# EAGLE design Klon_SiriusK (EAGLE 6.4)
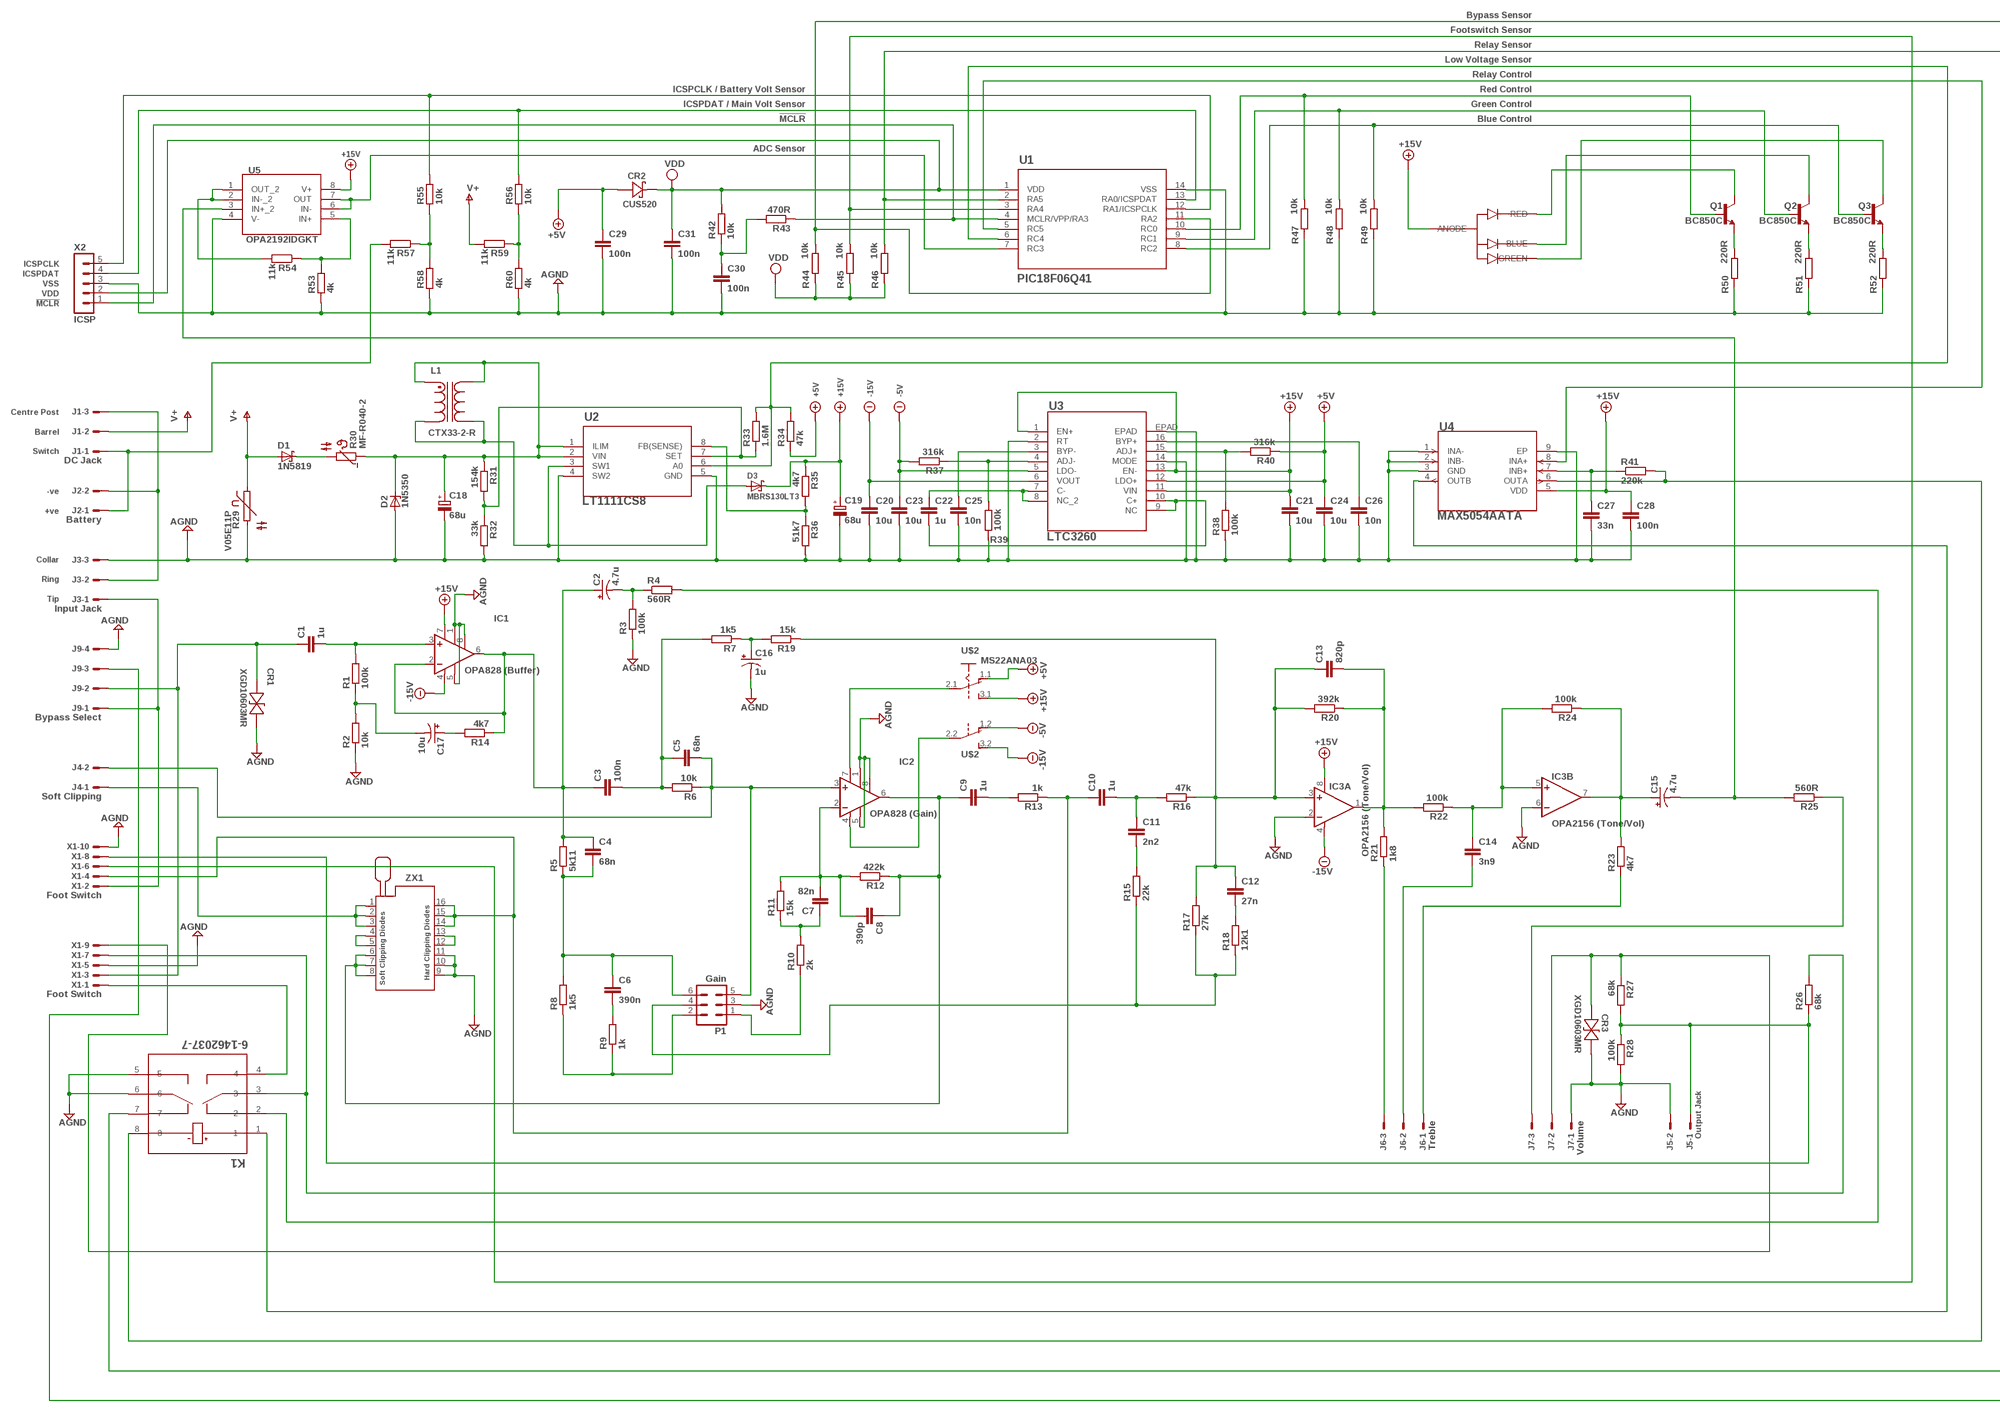
[diagram p0: schematic, sheet 1]

## Parts
C1  1u  C-EU225-108X268  [C225-108X268]
C2  4.7u  CPOL-USE15-5AXIAL  [E15-5]
C3  100n  C-EU102-064X133  [C102-064X133]
C4  68n  C-EU102-054X133  [C102-054X133]
C5  68n  C-EU102-054X133  [C102-054X133]
C6  390n  C-EU102-064X133  [C102-064X133]
C7  82n  C-EU102-064X133  [C102-064X133]
C8  390p  C-EU050-045X075  [C050-045X075]
C9  1u  C-EU225-108X268  [C225-108X268]
C10  1u  C-EU225-108X268  [C225-108X268]
C11  2n2  C-EU075-042X103  [C075-042X103]
C12  27n  C-EU102-064X133  [C102-064X133]
C13  820p  C-EU050-050X075  [C050-050X075]
C14  3n9  C-EU102-064X133  [C102-064X133]
C15  4.7u  CPOL-USE15-5AXIAL  [E15-5]
C16  1u  CPOL-USE2.5-4V  [E2,5RE]
C17  10u  CPOL-USE5-9VAXIAL  [E5R]
C18  68u  CPOL-EUSANYO_SMD_F12  [SANYO-OSCON_SMD_F12]
C19  68u  CPOL-EUSANYO_SMD_F12  [SANYO-OSCON_SMD_F12]
C20  10u  C-EUC1206K  [C1206K]
C21  10u  C-EUC1206K  [C1206K]
C22  1u  C-EUC0805K  [C0805K]
C23  10u  C-EUC1206K  [C1206K]
C24  10u  C-EUC1206K  [C1206K]
C25  10n  C-EUC0603K  [C0603K]
C26  10n  C-EUC0603K  [C0603K]
C27  33n  C-EUC0603K  [C0603K]
C28  100n  C-EUC0603K  [C0603K]
C29  100n  C-EUC0603K  [C0603K]
C30  100n  C-EUC0603K  [C0603K]
C31  100n  C-EUC0603K  [C0603K]
CR1  XGD10603MR  XGD10603NRZDO_XGD10603NR_LTF-M  [ZDO_XGD10603NR_LTF-M]
CR2  CUS520  CUS520USC_TOS-M  [USC_TOS-M]
CR3  XGD10603MR  XGD10603NRZDO_XGD10603NR_LTF-M  [ZDO_XGD10603NR_LTF-M]
D1  1N5819  1N5819-T  [DO41-7.6]
D2  1N5350  1N5333  [C1702-15]
D3  MBRS130LT3  [SMB]
IC1  OPA828 (Buffer)  OPA627P  [DIL08]
IC2  OPA828 (Gain)  OPA627P  [DIL08]
IC3  OPA2156 (Tone/Vol)  OPA2134P  [DIL08]
J1  DC Jack  22-27-2031-03  [6410-03]
J2  Battery  22-27-2021-02  [6410-02]
J3  Input Jack  22-27-2031-03  [6410-03]
J4  Soft Clipping  22-27-2021-02  [6410-02]
J5  Output Jack  22-27-2021-02  [6410-02]
J6  Treble  22-27-2031-03  [6410-03]
J7  Volume  22-27-2031-03  [6410-03]
J9  Bypass Select  22-27-2041-04  [6410-04]
K1  6-1462037-7  [RELAY8_SMTGUL_TEC]
L1  CTX33-2-R  [INDM889889X597N]
LED  WP154A4SEJ3VBDZGW/CA  5MMRGBLED  [LED5MMRGB]
P1  Gain  87831-06  [87831-06]
Q1  BC850C  BC850SMD  [SOT23-BEC]
Q2  BC850C  BC850SMD  [SOT23-BEC]
Q3  BC850C  BC850SMD  [SOT23-BEC]
R1  100k  R-EU_0309/12  [0309/12]
R2  10k  R-EU_0309/12  [0309/12]
R3  100k  R-EU_0309/12  [0309/12]
R4  560R  R-EU_0309/12  [0309/12]
R5  5k11  R-EU_0309/12  [0309/12]
R6  10k  R-EU_0309/12  [0309/12]
R7  1k5  R-EU_0309/12  [0309/12]
R8  1k5  R-EU_0309/12  [0309/12]
R9  1k  R-EU_0309/12  [0309/12]
R10  2k  R-EU_0309/12  [0309/12]
R11  15k  R-EU_0309/12  [0309/12]
R12  422k  R-EU_0309/12  [0309/12]
R13  1k  R-EU_0309/12  [0309/12]
R14  4k7  R-EU_0309/12  [0309/12]
R15  22k  R-EU_0309/12  [0309/12]
R16  47k  R-EU_0309/12  [0309/12]
R17  27k  R-EU_0309/12  [0309/12]
R18  12k1  R-EU_0309/12  [0309/12]
R19  15k  R-EU_0309/12  [0309/12]
R20  392k  R-EU_0309/12  [0309/12]
R21  1k8  R-EU_0309/12  [0309/12]
R22  100k  R-EU_0309/12  [0309/12]
R23  4k7  R-EU_0309/12  [0309/12]
R24  100k  R-EU_0309/12  [0309/12]
R25  560R  R-EU_0309/12  [0309/12]
R26  68k  R-EU_0309/12  [0309/12]
R27  68k  R-EU_0309/12  [0309/12]
R28  100k  R-EU_0309/12  [0309/12]
R29  V05E11P  S05K11  [S05K11]
R30  MF-R040-2  B57164  [B57164]
R31  154k  R-EU_R0603  [R0603]
R32  33k  R-EU_R0603  [R0603]
R33  1.6M  R-EU_R0603  [R0603]
R34  47k  R-EU_R0603  [R0603]
R35  4k7  R-EU_R0603  [R0603]
R36  51k7  R-EU_R0603  [R0603]
R37  316k  R-EU_R0603  [R0603]
R38  100k  R-EU_R0603  [R0603]
R39  100k  R-EU_R0603  [R0603]
R40  316k  R-EU_R0603  [R0603]
R41  220k  R-EU_R0603  [R0603]
R42  10k  R-EU_R0603  [R0603]
R43  470R  R-EU_R0603  [R0603]
R44  10k  R-EU_R0603  [R0603]
R45  10k  R-EU_R0603  [R0603]
R46  10k  R-EU_R0603  [R0603]
R47  10k  R-EU_R0603  [R0603]
R48  10k  R-EU_R0603  [R0603]
R49  10k  R-EU_R0603  [R0603]
R50  220R  R-EU_R0603  [R0603]
R51  220R  R-EU_R0603  [R0603]
R52  220R  R-EU_R0603  [R0603]
R53  4k  R-EU_R0603  [R0603]
R54  11k  R-EU_R0603  [R0603]
R55  10k  R-EU_R0603  [R0603]
R56  10k  R-EU_R0603  [R0603]
R57  11k  R-EU_R0603  [R0603]
R58  4k  R-EU_R0603  [R0603]
R59  11k  R-EU_R0603  [R0603]
R60  4k  R-EU_R0603  [R0603]
U1  PIC18F06Q41  PIC16F18426-I/STTSSOP14_ST_MCH-M  [TSSOP14_ST_MCH-M]
U2  LT1111CS8  LT1111CS8-5PBFSO-8_S_LIT-M  [SO-8_S_LIT-M]
U3  LTC3260  LTC3260IMSEPBFMSOP-16_MSE_LIT-M  [MSOP-16_MSE_LIT-M]
U4  MAX5054AATA  MAX5054AATA+T21-0137_T833+2_MXM-M  [21-0137_T833+2_MXM-M]
U5  OPA2192IDGKT  [DGK0008A_N_TEX]
U$2  MS22ANA03  [MS22ANA03]
X1  Foot Switch  87758-1016  [87758-1016]
X2  ICSP  MA05-1  [MA05-1]
ZX1  216-3340-00-0602J  [216-3340-00-0602J]

## Nets
+5V: C24.1 C29.1 CR2.2(ANODE) R34.1 R40.1 U3.12(LDO+) U$2.1.1(A:O)
+15V: C19.+ C21.1 C28.1 D3.C IC1.7(V+) IC3.8(A:V+) LED.P2(ANODE) R35.1 U3.1(EN+) U3.11(VIN) U3.13(EN-) U4.5(VDD) U5.8(V+) U$2.3.1(A:S)
-5V: C23.1 R37.2 U3.5(LDO-) U$2.1.2(B:O)
-15V: C20.1 IC1.4(V-) IC3.4(A:V-) U3.6(VOUT) U$2.3.2(B:S)
AGND: C16.- C18.- C19.- C20.2 C21.2 C23.2 C24.2 C25.2 C26.2 C27.2 C28.2 C29.2 C30.2 C31.2 CR1.1 CR3.1 D2.A IC1.1(TRIM1) IC1.5(TRIM2) IC1.8(NC) IC2.1(TRIM1) IC2.5(TRIM2) IC2.8(NC) IC3.2(A:-IN) IC3.6(B:-IN) J3.3 J5.2 J7.1 J9.4 K1.5 K1.6 P1.3 R2.1 R3.1 R28.2 R29.2 R32.2 R36.2 R38.1 R39.1 R47.1 R48.1 R49.1 R50.1 R51.1 R52.1 R53.1 R58.1 R60.1 U1.14(VSS) U2.4(SW2) U2.5(GND) U3.2(RT) U3.14(MODE) U3.EPAD U4.1(INA-) U4.2(INB-) U4.3(GND) U4.9(EP) U5.4(V-) X1.5 X1.10 X2.3 ZX1.9 ZX1.10 ZX1.11
N$1: J1.1 J2.1 R57.2
N$2: J1.3 J2.2 J3.2
N$3: C1.1 CR1.2 J9.2 X1.3
N$4: C1.2 IC1.3(+IN) R1.2
N$5: C17.- R1.1 R2.2
N$6: C2.+ C3.1 C4.1 IC1.2(-IN) IC1.6(OUT) R5.2 R14.1
N$7: D1.C R30.2
N$8: C17.+ R14.2
N$9: R37.1 R39.2 U3.4(ADJ-)
N$10: C13.2 IC3.1(A:OUT) R20.1 R21.2 R22.2
N$11: C4.2 C6.1 P1.6 R5.1 R8.2
N$12: C2.- R3.2 R4.1
N$13: C3.2 C5.1 R6.2 R7.2
N$14: C5.2 IC2.3(+IN) J4.2 P1.5 R6.1
N$15: C16.+ R7.1 R19.2
N$16: C6.2 R9.2
N$17: P1.2 R8.1 R9.1
N$18: C14.1 IC3.5(B:+IN) R22.1 R24.2
N$19: IC2.7(V+) U$2.2.1(A:P)
N$20: IC2.4(V-) U$2.2.2(B:P)
N$21: P1.4 R15.1 R17.1 R18.1
N$22: ZX1.4 ZX1.5
N$23: ZX1.12 ZX1.13
N$24: C10.1 R13.1 X1.4 ZX1.14 ZX1.15 ZX1.16
N$25: J6.3 R21.1
N$26: C14.2 J6.2
N$27: J4.1 ZX1.1 ZX1.2 ZX1.3
N$28: C15.+ IC3.7(B:OUT) R23.2 R24.1
N$29: P1.1 R10.1
N$30: C7.1 R10.2 R11.1
N$31: C7.2 C8.2 IC2.2(-IN) R11.2 R12.2
N$32: J6.1 R23.1
N$33: C8.1 C9.1 IC2.6(OUT) R12.1 ZX1.6 ZX1.7 ZX1.8
N$34: C15.- R25.2 U5.3(IN+_2)
N$35: J7.3 R25.1
N$36: J3.1 J9.1 X1.2
N$37: C9.2 R13.2
N$38: J5.1 R26.1 R27.2 R28.1 X1.8
N$39: C10.2 C11.1 R16.2
N$40: C11.2 R15.2
N$41: C12.1 C13.1 IC3.3(A:+IN) R16.1 R17.2 R19.1 R20.2
N$42: C12.2 R18.2
N$43: CR3.2 J7.2 R27.1 X1.9
N$44: K1.4 X1.1
N$45: K1.2 R4.2
N$46: K1.3 R26.2 X1.7
N$47: K1.1 U4.4(OUTB)
N$48: K1.8 R41.2 U4.6(OUTA)
N$49: Q3.E R52.2
N$50: Q2.E R51.2
N$51: J9.3 R44.2 U1.11(RA2)
N$52: R31.2 R32.1 R33.1 U2.7(SET)
N$53: Q1.E R50.2
N$54: C18.+ D2.C L1.1 L1.4 R30.1 R31.1 U2.1(ILIM) U2.2(VIN)
N$55: C22.1 U3.7(C-) U3.8(NC_2)
N$56: D3.A L1.2 L1.3 U2.3(SW1)
N$57: R35.2 R36.1 U2.8(FB(SENSE))
N$59: R38.2 R40.2 U3.15(ADJ+)
N$60: C27.1 R41.1 U4.7(INB+)
N$61: R54.2 U5.1(OUT_2) U5.2(IN-_2)
N$62: R56.2 U1.13(RA0/ICSPDAT) X2.4
N$63: C26.1 U3.16(BYP+)
N$64: R55.2 U1.12(RA1/ICSPCLK) X2.5
N$65: C25.1 U3.3(BYP-)
N$66: R43.1 U1.4(MCLR/VPP/RA3) X2.1
N$67: K1.7 R46.2 U1.2(RA5)
N$69: R45.2 U1.3(RA4) X1.6
N$70: C30.1 R42.1 R43.2
N$71: LED.P1(RED) Q1.C
N$72: U1.5(RC5) U4.8(INA+)
N$73: Q1.B R47.2 U1.10(RC0)
N$74: Q2.B R48.2 U1.9(RC1)
N$75: Q3.B R49.2 U1.8(RC2)
N$76: R33.2 R34.2 U1.6(RC4) U2.6(A0)
N$77: LED.P3(BLUE) Q2.C
N$78: LED.P4(GREEN) Q3.C
N$79: U1.7(RC3) U5.6(IN-) U5.7(OUT)
N$80: R56.1 R59.1 R60.2
N$81: R53.2 R54.1 U5.5(IN+)
N$82: R55.1 R57.1 R58.2
N$83: C22.2 U3.9(NC) U3.10(C+)
V+: D1.A J1.2 R29.1 R59.2
VDD: C31.1 CR2.1(CATHODE) R42.2 R44.1 R45.1 R46.1 U1.1(VDD) X2.2

## Notes on the sheet
- Bypass Sensor
- Footswitch Sensor
- Relay Sensor
- Low Voltage Sensor
- Relay Control
- ICSPCLK / Battery Volt Sensor | Red Control
- ICSPDAT / Main Volt Sensor | Green Control
- !MCLR! | Blue Control
- ADC Sensor
- ICSPCLK
- ICSPDAT
- VSS
- VDD
- !MCLR!
- Centre Post
- Barrel
- Switch
- -ve
- +ve
- Collar
- Ring
- Tip
- Hard Clipping Diodes
- Soft Clipping Diodes

## Library data of the parts
C1 C3-C14 C20-C31 = rcl:C-EU: CAPACITOR, European symbol
C2 C15-C17 = rcl:CPOL-US: POLARIZED CAPACITOR, American symbol
C18 C19 = rcl:CPOL-EU: POLARIZED CAPACITOR, European symbol
CR1 CR3 = XGD10603:XGD10603NR; BUILT_BY: EMA_Cory; COPYRIGHT: Copyright (C) 2018 Accelerated Designs. All rights reserved; DATASHEET: https://www.littelfuse.com/~/media/electronics/datasheets/polymer_esd_suppressors/littelfuse_xtremeguard_xgd_datasheet.pdf.pdf; MANUFACTURER_PART_NUMBER: XGD10603NR; SOURCELIBRARY: LittleFuse_2020-02-24; VENDOR: Littelfuse Inc
CR2 = CUS520_Schottky_Diode:CUS520; BUILT_BY: EMA_TJ; COPYRIGHT: Copyright (C) 2016 Accelerated Designs. All rights reserved; MANUFACTURER_PART_NUMBER: CUS520; SOURCELIBRARY: Toshiba_2018-09-20; VENDOR: Toshiba
D1 = diode:1N581*: 1.0A SCHOTTKY BARRIER RECTIFIER Source: http://www.diodes.com/datasheets/ds23001.pdf
D2 = diode:1N5333: Z DIODE 3.3 V, 5W, 5 percent (Motorola)
D3 = diode:MBRS130LT3: Schottky Power Rectifier Source: http://www.onsemi.com/pub/Collateral/MBRS130LT3-D.PDF
IC1 IC2 = burr-brown:OPA627: Difet(R) Operational Amplifiers Precision, High-Speed; MF: TEXAS INSTRUMENTS; MPN: OPA627BP; OC_FARNELL: 1212318; OC_NEWARK: 35C1918
IC3 = burr-brown:OPA2134: Operational Amplifier; MF: TEXAS INSTRUMENTS; MPN: OPA2134PA; OC_FARNELL: 1097574; OC_NEWARK: 74K3897
J1 J3 J6 J7 = con-molex:22-?-03: CONNECTOR wire to board 2.54 mm (.1 inch) pitch header; OC_FARNELL: unknown; OC_NEWARK: unknown
J2 J4 J5 = con-molex:22-?-02: CONNECTOR wire to board 2.54 mm (.1 inch) pitch header; OC_FARNELL: unknown; OC_NEWARK: unknown
J9 = con-molex:22-?-04: CONNECTOR wire to board 2.54 mm (.1 inch) pitch header; OC_FARNELL: unknown; OC_NEWARK: unknown
K1 = TE_Potter_Brumfield-6-1462037-7:6-1462037-7; BUILT_BY: EMA_UL_Team; CONTACT_ARRANGEMENT: 2 Form C (CO); COPYRIGHT: Copyright (C) 2016 Accelerated Designs. All rights reserved; DESCRIPTION: IM46GR=IM RELAY 100 MW 12 V BI; MANUFACTURER_PART_NUMBER: 6-1462037-7; MAXIMUM_SWITCHING_CURRENT: -; MAXIMUM_SWITCHING_VOLTAGE: -; PRODUCT_TYPE: Relay; RELAY_TYPE: IM Relay; SOURCELIBRARY: TE_Connectivity-2018-03-16; TE_PART_NUMBER: 6-1462037-7; VENDOR: TE Connectivity
L1 = CTX33-2-R:CTX33-2-R: POWER INDUCTOR Check prices <https://pricing.snapeda.com/parts/CTX33-2-R/Cooper%20Bussmann/view-part?ref=eda>; AVAILABILITY: Warning; DESCRIPTION: Inductor Power Wirewound 31.77uH/127.09uH 20% 100KHz Amorphous Metal 1.4A/0.7A 105mOhm/420mOhm DCR T/R; MF: Cooper Bussmann; MP: CTX33-2-R; PACKAGE: Nonstandard Cooper Bussmann; PRICE: None; PURCHASE-URL: https://pricing.snapeda.com/search/part/CTX33-2-R/?ref=eda
LED = led_rgb:5MMRGBLED
P1 = con-molex-milli-grid:87831-06: HEADER
Q1-Q3 = transistor-npn:BC850*: NPN Transistor
R1-R28 R31-R60 = rcl:R-EU_: RESISTOR, European symbol
R29 = varistor:S05K11: VARISTOR
R30 = ptc-ntc:B57164: SIEMENS NTC; MPN: B57164K474K52; OC_FARNELL: 9753451; OC_NEWARK: 29M3118
U1 = PIC16F18426:PIC16F18426-I/ST; BUILT_BY: EMA_Cory; COPYRIGHT: Copyright (C) 2018 Accelerated Designs. All rights reserved; DATASHEET: https://ww1.microchip.com/downloads/en/DeviceDoc/40001985B.pdf; MANUFACTURER_PART_NUMBER: PIC16F18426-I/ST; SOURCELIBRARY: Microchip_2020-10-12; VENDOR: Microchip
U2 = LT1111:LT1111CS8-5PBF; BUILT_BY: EMA_UL_Team; MANUFACTURER_PART_NUMBER: LT1111CS8-5#PBF; SOURCELIBRARY: LinearTech_2016-05-13_8; VENDOR: Linear Technology
U3 = LTC3260:LTC3260IMSEPBF; BUILT_BY: EMA_UL_Team; MANUFACTURER_PART_NUMBER: LTC3260IMSE#PBF; SOURCELIBRARY: LinearTech_2016-05-13_7; VENDOR: Linear Technology
U4 = MAX5054A:MAX5054AATA+T; BUILT_BY: EMA_UL_Team; MANUFACTURER_PART_NUMBER: max5054aata+T; REVISION: 3; SOURCELIBRARY: Update_to_database_2021-03-24; VENDOR: Maxim Integrated Products
U5 = OPA2192:OPA2192IDGKT; BUILT_BY: EMA_UL_Team; COPYRIGHT: Copyright (C) 2018 Accelerated Designs. All rights reserved; MANUFACTURER_PART_NUMBER: OPA2192IDGKT; SOURCELIBRARY: TI_2019-03-28; VENDOR: Texas Instruments
U$2 = switch-nkk:MS22ANA03
X1 = con-molex:87758-1016: 10 Pin - 2mm Dual Row Single Wafer, Vertical T/H HDR Source: http://www.molex.com/pdm_docs/sd/877580616_sd.pdf; MF: MOLEX; MPN: 87758-1016; OC_FARNELL: 7472340; OC_NEWARK: 59J1558
X2 = con-lstb:MA05-1: PIN HEADER; OC_FARNELL: unknown; OC_NEWARK: unknown
ZX1 = con-3m:216-3340-00-0602J: Zero Insertion Force Socked Source: http://www.3M.com/ehpd; MF: 3M; MPN: 216-3340-00-0602J; OC_FARNELL: 1674399; OC_NEWARK: 85K7797

## Board
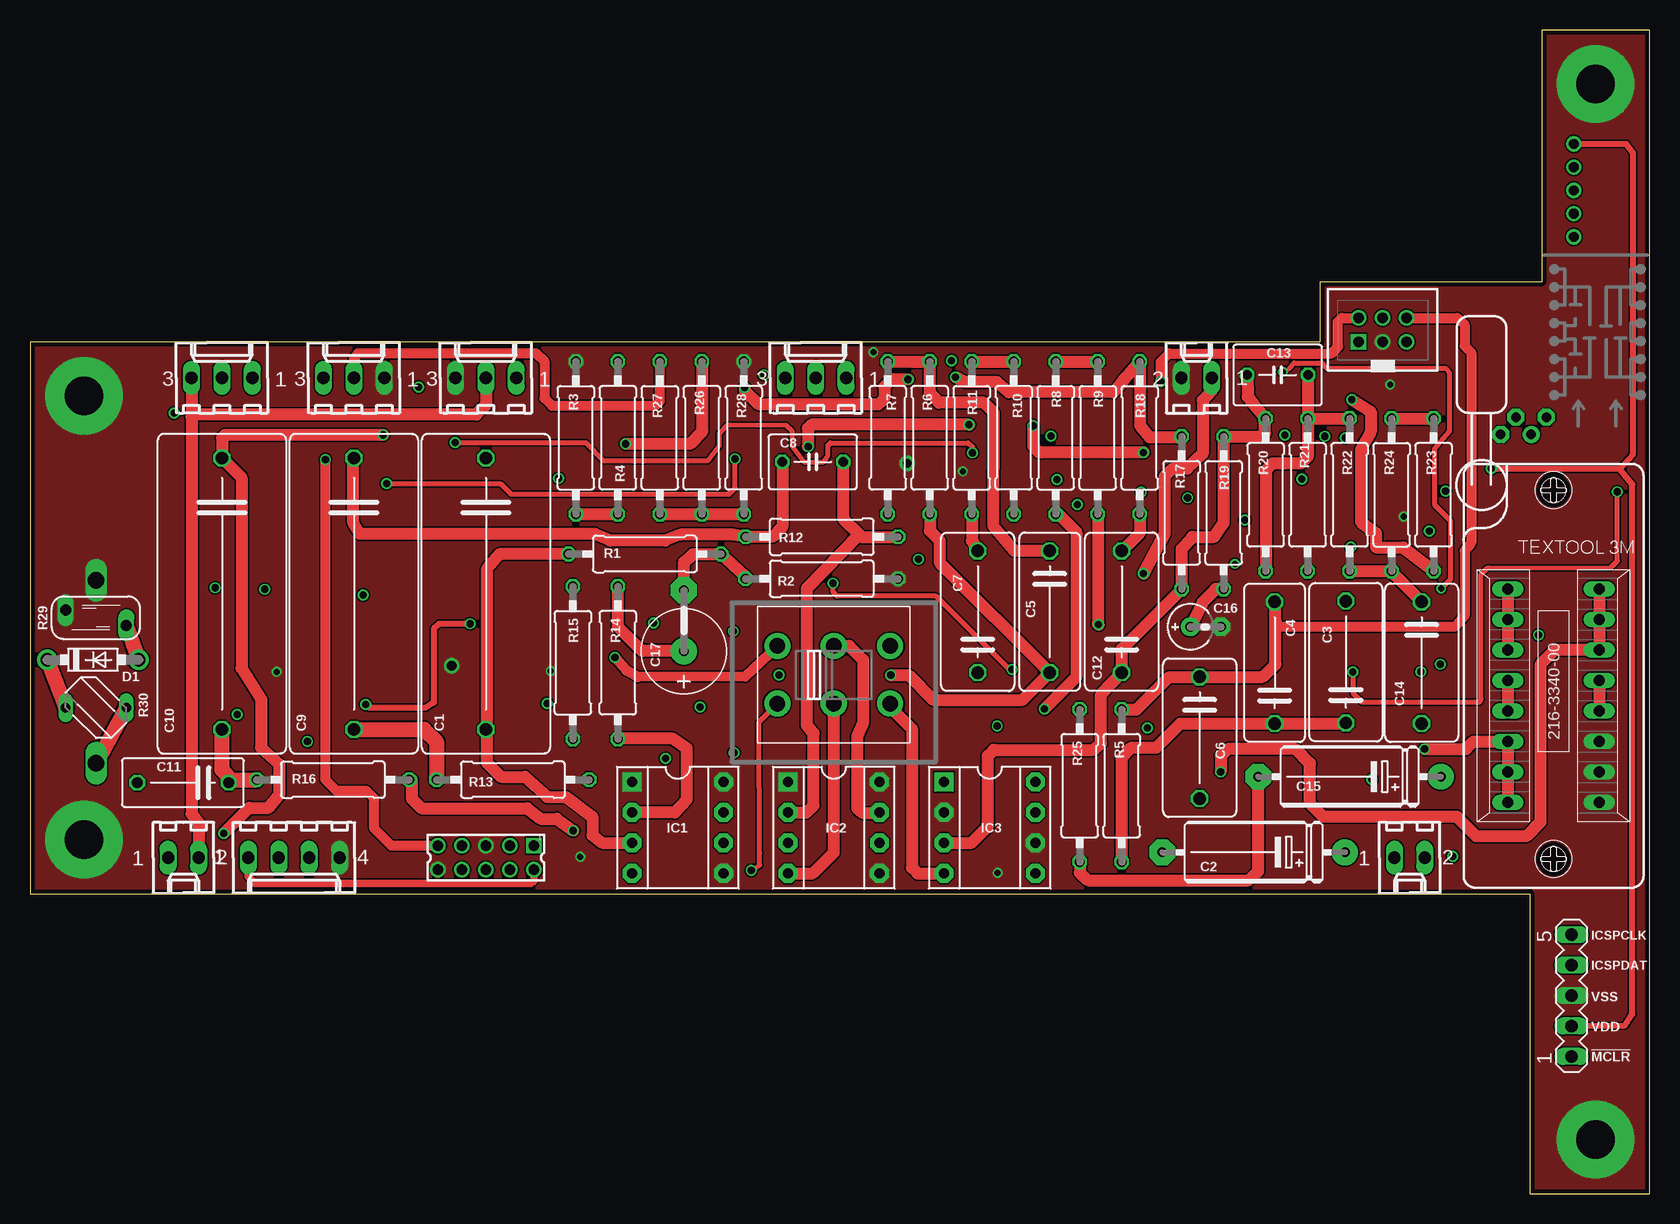
[diagram p1: board, top side]
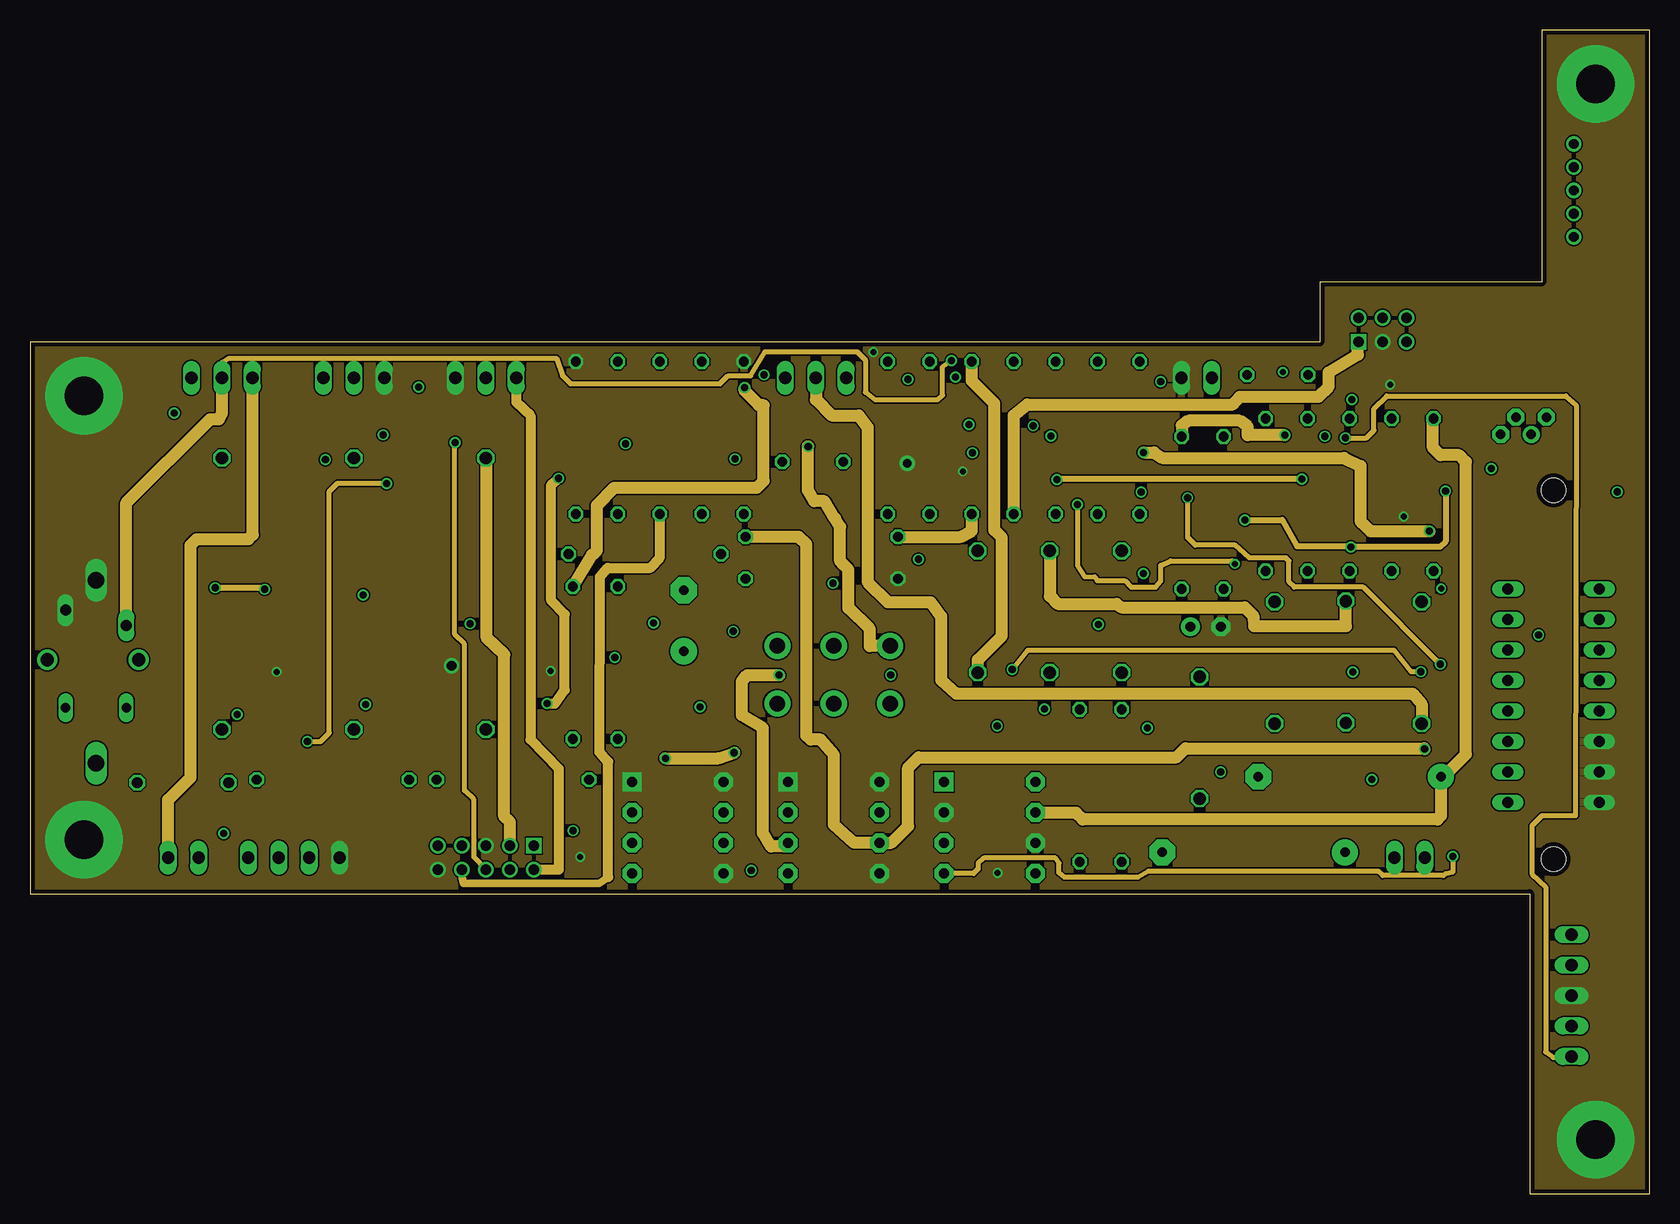
[diagram p2: board, inner layer Route2]
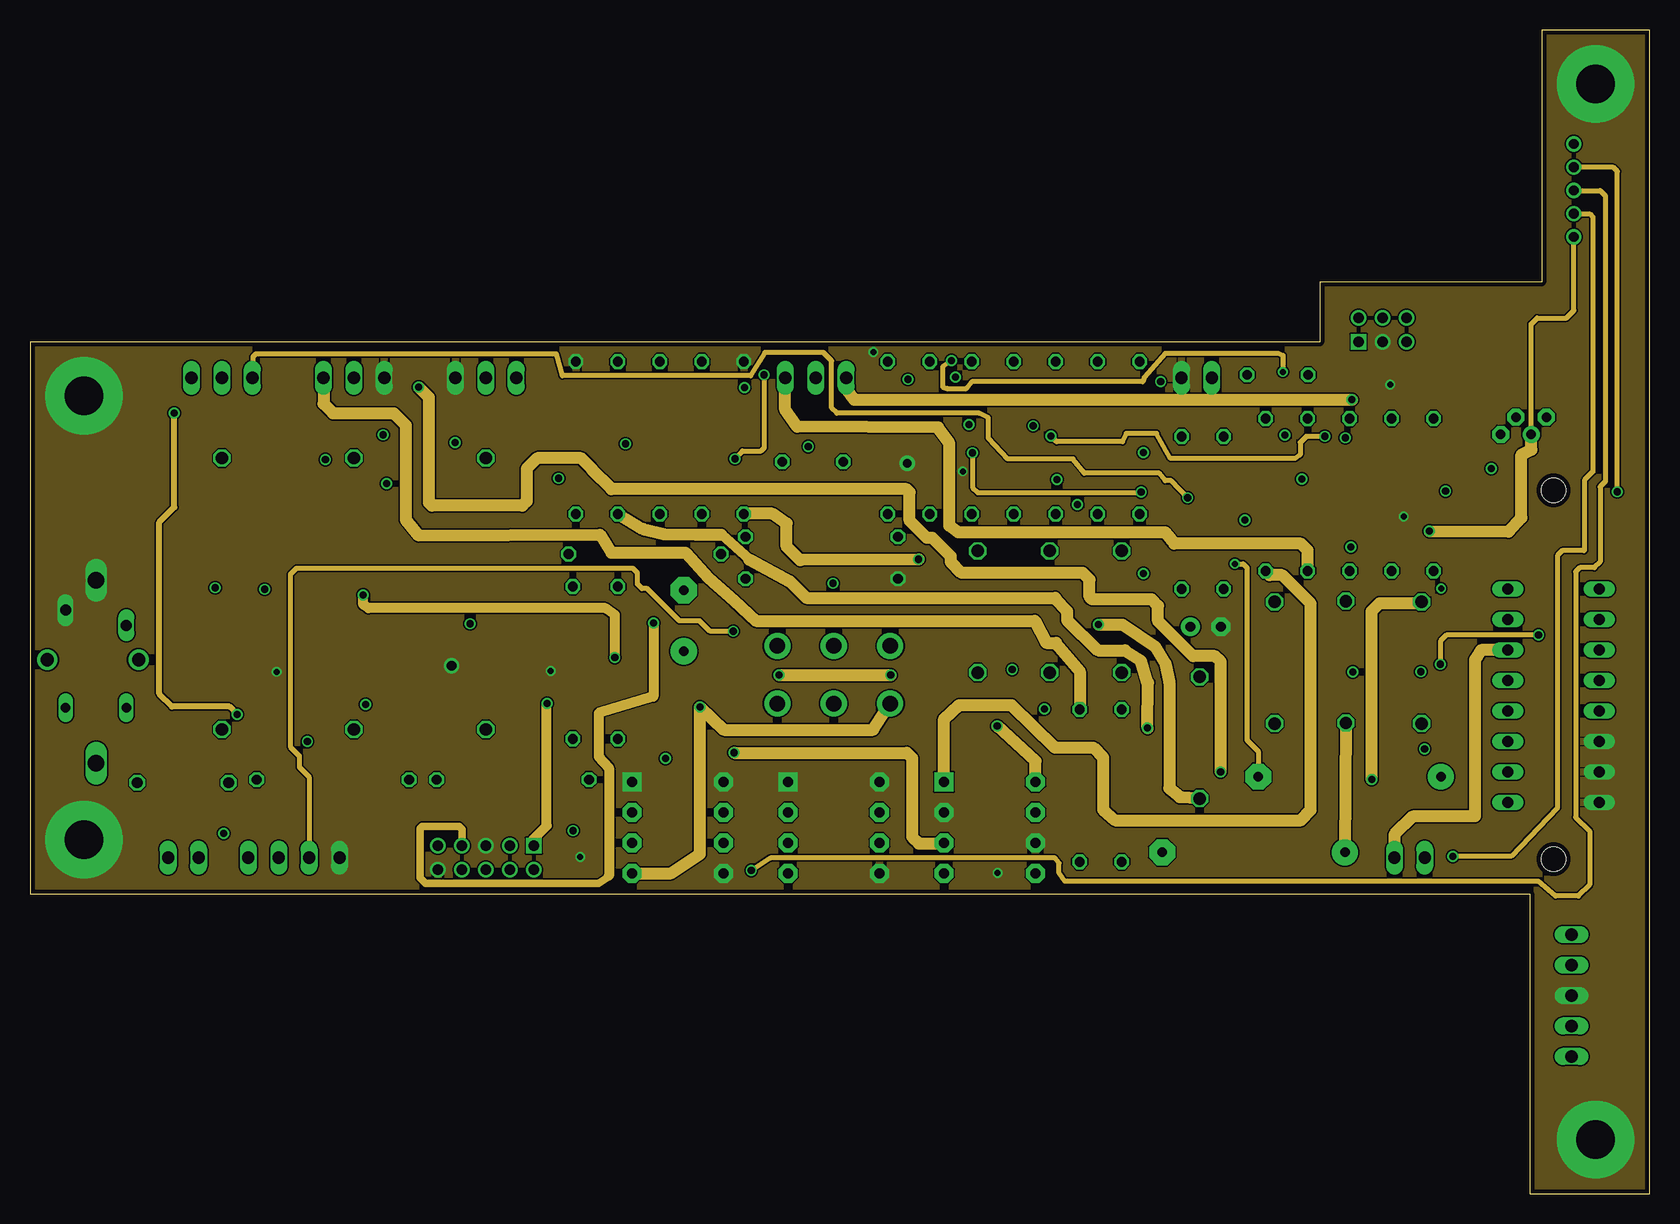
[diagram p3: board, inner layer Route15]
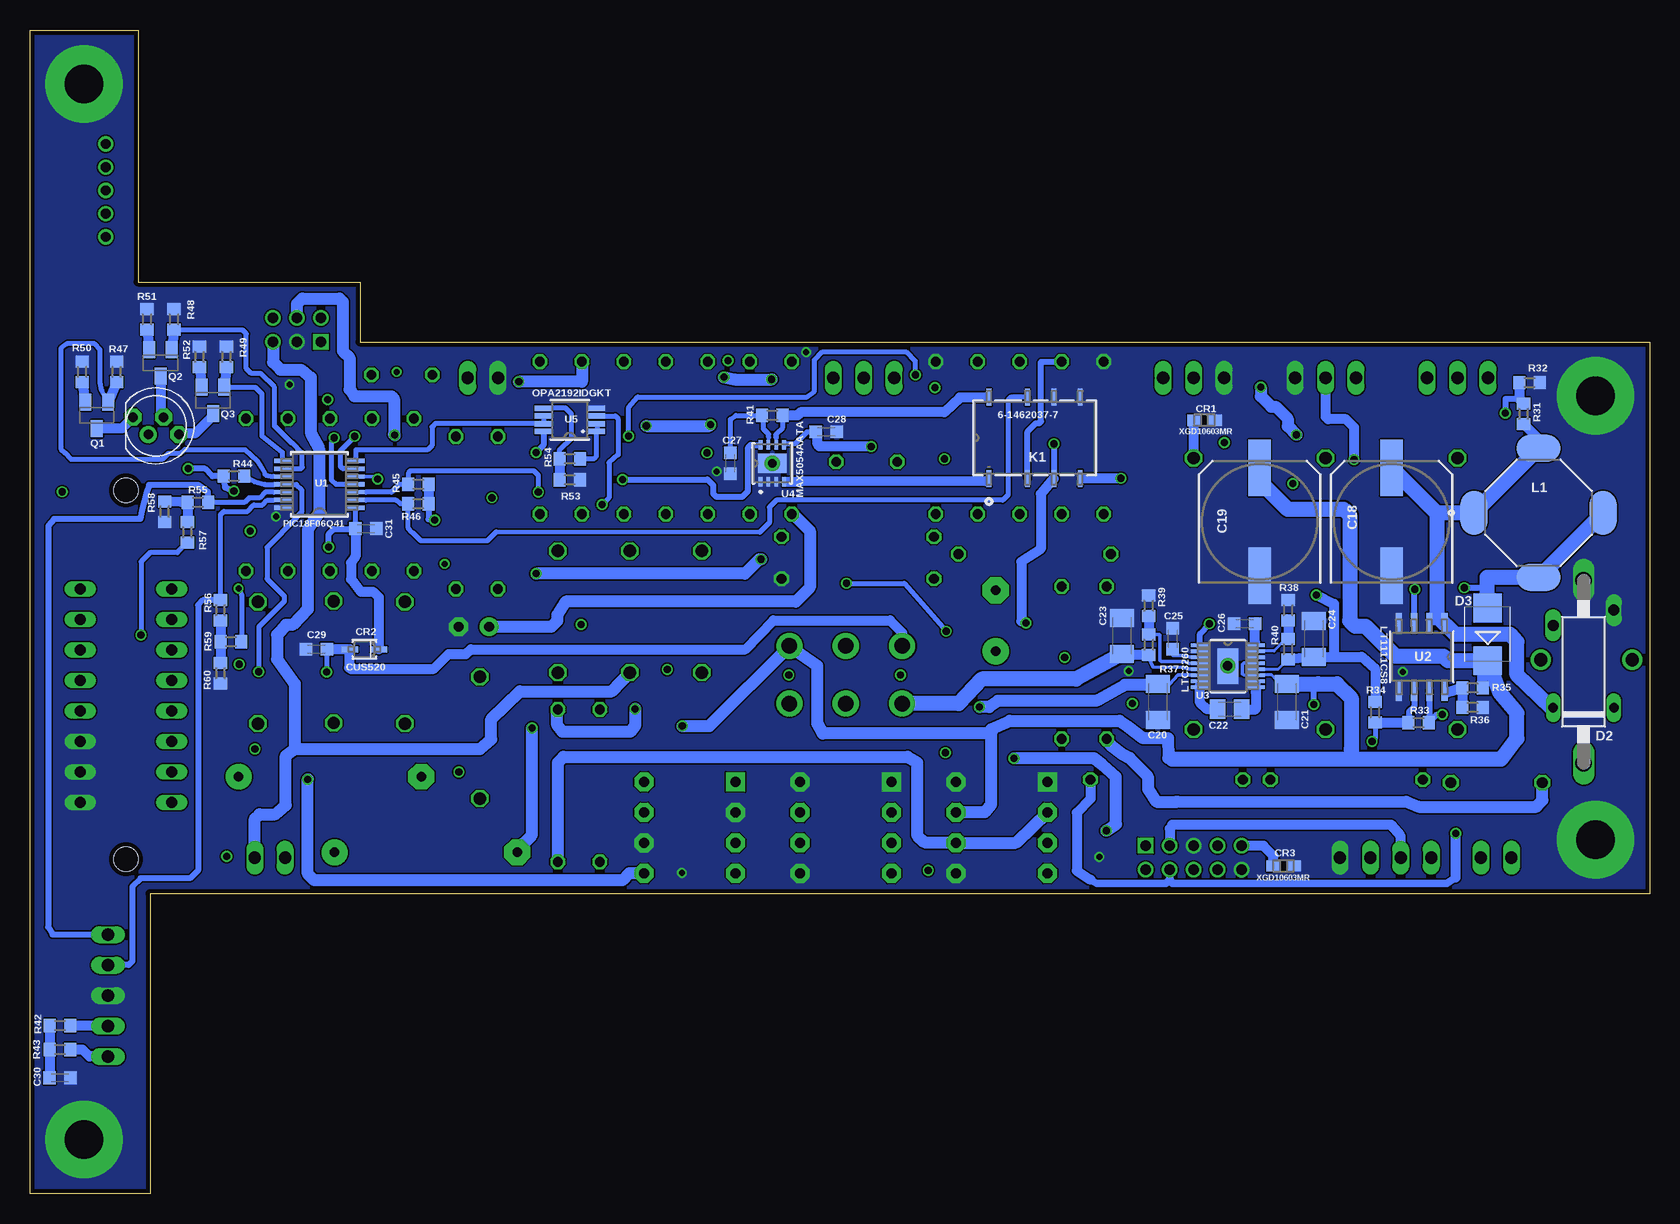
[diagram p4: board, bottom side, seen from below]

Size 135 x 97 mm. Coordinates in mm from the lower left corner, seen from the top.
Outline: 0,25 125,25 125,0 135,0 135,97 126,97 126,76 107.5,76 107.5,71 0,71 0,25
Copper layers (1+2*15+16): Top 0.035mm / dielectric 0.2mm / Route2 0.035mm / dielectric 1.5mm / Route15 0.035mm / dielectric 0.2mm / Bottom 0.035mm
Design rules "sadek_eagle_designrules_4layer *": minimum track width 5mil, minimum drill 12mil, track to track 5mil, track to pad 5mil, pad to pad 5mil, via to via 5mil, smd to smd 0mil, copper to edge 15mil, drill to drill 8mil, minimum pad ring 8mil, minimum via ring 6mil, stop-mask expansion 3mil, vias tented up to drill 0mil, thermal gap 0mil

### Footprints (pad centres in the part's own frame; a part is rotated, then mirrored left to right if it is on the bottom)
C225-108X268 = drill 1.016 octagon: 1 -11.303,0; 2 11.303,0
E15-5 = drill 0.813 pad 2.159: + -7.62,0 | drill 0.813 pad 2.159 octagon: - 7.62,0
C102-064X133 = drill 1.016 octagon: 1 -5.08,0; 2 5.08,0
C102-054X133 = drill 1.016 octagon: 1 -5.08,0; 2 5.08,0
C050-045X075 = drill 0.813 octagon: 1 -2.54,0; 2 2.54,0
C075-042X103 = drill 0.914 octagon: 1 -3.81,0; 2 3.81,0
C050-050X075 = drill 0.813 octagon: 1 -2.54,0; 2 2.54,0
E2,5RE = drill 0.813 pad 1.575: + -1.27,0 | drill 0.813 pad 1.575 octagon: - 1.27,0
E5R = drill 0.813 pad 2.184: + -2.54,0 | drill 0.813 pad 2.184 octagon: - 2.54,0
SANYO-OSCON_SMD_F12 = smd 4.7 x 1.9: + 4.5,0; - -4.5,0
C1206K = smd 1.5 x 2: 1 -1.5,0; 2 1.5,0
C0805K = smd 1.3 x 1.6: 1 -1,0; 2 1,0
C0603K = smd 1.05 x 1.08: 1 -0.875,0; 2 0.875,0
ZDO_XGD10603NR_LTF-M = smd 1.168 x 0.94: 1 -0.851,0; 2 0.851,0
USC_TOS-M = smd 1.4 x 0.5: 1 -1.2,0; 2 1.2,0
DO41-7.6 = drill 1.1 pad 1.7: A 3.81,0; C -3.81,0
C1702-15 = drill 1.397 long: A 7.62,0; C -7.62,0
SMB = smd 2.4 x 2.4: A 2.2,0; C -2.2,0
DIL08 = drill 0.813 pad 1.6 square: 1 -3.81,-3.81 | drill 0.813 pad 1.6 octagon: 2 -1.27,-3.81; 3 1.27,-3.81; 4 3.81,-3.81; 5 3.81,3.81; 6 1.27,3.81; 7 -1.27,3.81; 8 -3.81,3.81
6410-03 = drill 1.016 long: 1 2.54,0; 2 0,0; 3 -2.54,0
6410-02 = drill 1.016 long: 1 1.27,0; 2 -1.27,0
6410-04 = drill 1.016 long: 1 3.81,0; 2 1.27,0; 3 -1.27,0; 4 -3.81,0
RELAY8_SMTGUL_TEC = smd 1.422 x 0.406: 1 -3.391,3.804; 2 -3.391,0.604; 3 -3.391,-1.596; 4 -3.391,-3.796; 5 3.391,-3.796; 6 3.391,-1.596; 7 3.391,0.604; 8 3.391,3.804
INDM889889X597N = smd 2.261 x 3.683: 1 -5.385,0; 3 5.385,0 | smd 3.683 x 2.261: 2 0,-5.385; 4 0,5.385
LED5MMRGB = drill 0.8 pad 1.422 octagon: P1 -1.905,0.714; P3 0.635,0.714; P4 1.905,-0.714 | drill 0.8 pad 1.422: P2 -0.635,-0.714
87831-06 = drill 0.914 square: 1 -2,-1 | drill 0.914: 2 -2,1; 3 0,-1; 4 0,1; 5 2,-1; 6 2,1
SOT23-BEC = smd 1 x 1.4: B -0.95,-1.1; C 0,1.1; E 0.95,-1.1
0309/12 = drill 0.813 octagon: 1 -6.35,0; 2 6.35,0
S05K11 = drill 0.914 long: 1 -0.635,-2.54; 2 0.635,2.54
B57164 = drill 0.813 long: 1 -2.54,0; 2 2.54,0
R0603 = smd 1 x 1.1: 1 -0.85,0; 2 0.85,0
TSSOP14_ST_MCH-M = smd 1.511 x 0.356: 1 -3.004,1.95; 2 -3.004,1.3; 3 -3.004,0.65; 4 -3.004,0; 5 -3.004,-0.65; 6 -3.004,-1.3; 7 -3.004,-1.95; 8 3.004,-1.95; 9 3.004,-1.3; 10 3.004,-0.65; 11 3.004,0; 12 3.004,0.65; 13 3.004,1.3; 14 3.004,1.95
SO-8_S_LIT-M = smd 1.664 x 0.533: 1 -2.826,1.905; 2 -2.826,0.635; 3 -2.826,-0.635; 4 -2.826,-1.905; 5 2.826,-1.905; 6 2.826,-0.635; 7 2.826,0.635; 8 2.826,1.905
MSOP-16_MSE_LIT-M = smd 1.537 x 0.279: 1 -2.318,1.751; 2 -2.318,1.251; 3 -2.318,0.751; 4 -2.318,0.25; 5 -2.318,-0.25; 6 -2.318,-0.751; 7 -2.318,-1.251; 8 -2.318,-1.751; 9 2.318,-1.751; 10 2.318,-1.251; 11 2.318,-0.751; 12 2.318,-0.25; 13 2.318,0.25; 14 2.318,0.751; 15 2.318,1.251; 16 2.318,1.751 | smd 1.753 x 2.946: EPAD 0,0
21-0137_T833+2_MXM-M = smd 0.806 x 0.306: 1 -1.546,0.975; 2 -1.546,0.325; 3 -1.546,-0.325; 4 -1.546,-0.975; 5 1.546,-0.975; 6 1.546,-0.325; 7 1.546,0.325; 8 1.546,0.975 | smd 1.6 x 2.388: 9 0,0
DGK0008A_N_TEX = smd 1.448 x 0.457: 1 -2.2,0.975; 2 -2.2,0.325; 3 -2.2,-0.325; 4 -2.2,-0.975; 5 2.2,-0.975; 6 2.2,-0.325; 7 2.2,0.325; 8 2.2,0.975
MS22ANA03 = drill 1.3 pad 2.184: 1.1 -4.699,2.4; 1.2 -4.699,-2.4; 2.1 0,2.4; 2.2 0,-2.4; 3.1 4.699,2.4; 3.2 4.699,-2.4
87758-1016 = drill 0.9 pad 1.27 square: 1 -4,-1 | drill 0.9 pad 1.27: 2 -4,1; 3 -2,-1; 4 -2,1; 5 0,-1; 6 0,1; 7 2,-1; 8 2,1; 9 4,-1; 10 4,1
MA05-1 = drill 1.016 long: 1 -5.08,0; 2 -2.54,0; 3 0,0; 4 2.54,0; 5 5.08,0
216-3340-00-0602J = drill 0.9 long: 1 -8.89,-3.81; 2 -6.35,-3.81; 3 -3.81,-3.81; 4 -1.27,-3.81; 5 1.27,-3.81; 6 3.81,-3.81; 7 6.35,-3.81; 8 8.89,-3.81; 9 8.89,3.81; 10 6.35,3.81; 11 3.81,3.81; 12 1.27,3.81; 13 -1.27,3.81; 14 -3.81,3.81; 15 -6.35,3.81; 16 -8.89,3.81 | hole 2: 13.62,0; -17.12,0

### Placement (x,y rotation side)
C1  38,50 270 top
C2  102,28.45 180 top
C3  109.7,44.3 90 top
C4  103.75,44.25 90 top
C5  85,48.5 270 top
C6  97.5,38 270 top
C7  79,48.5 90 top
C8  65.25,61 0 top
C9  27,50 270 top
C10  16,50 270 top
C11  12.75,34.25 180 top
C12  91,48.5 90 top
C13  104,68.25 0 top
C14  116,44.25 270 top
C15  110,34.75 180 top
C16  98,47.25 0 top
C17  54.5,47.75 90 top
C18  21.5,56 90 bottom
C19  32.5,56 90 bottom
C20  41,41 270 bottom
C21  30.25,41 270 bottom
C22  35,40.38 0 bottom
C23  44,46.5 90 bottom
C24  28,46.25 90 bottom
C25  39.75,46.25 90 bottom
C26  33.75,47.5 180 bottom
C27  76.62,60.88 270 bottom
C28  68.62,63.5 0 bottom
C29  111.12,45.38 180 bottom
C30  132.5,9.65 0 bottom
C31  107,55.42 0 bottom
CR1  37.09,64.47 180 bottom
CR2  107.12,45.38 180 bottom
CR3  30.5,27.31 180 bottom
D1  5.25,44.5 0 top
D2  5.5,43.5 90 bottom
D3  13.5,46.62 90 bottom
IC1  54,30.5 270 top
IC2  67,30.5 270 top
IC3  80,30.5 270 top
J1  16,68 0 top
J2  12.79,28 180 top
J3  38,68 0 top
J4  115,28 180 top
J5  97.25,68 0 top
J6  65.5,68 0 top
J7  27,68 0 top
J9  22,28 180 top
K1  51.25,63 90 bottom
L1  9.25,56.75 0 bottom
LED  124.5,64 0 bottom
P1  112.75,72 0 top
Q1  129.44,64.88 180 bottom
Q2  124.12,69.25 180 bottom
Q3  119.75,66.12 180 bottom
R1  51.25,53.31 180 top
R2  66,51.25 180 top
R3  45.5,63 270 top
R4  49,63 90 top
R5  91,34 270 top
R6  75,63 90 top
R7  71.5,63 90 top
R8  85.5,63 270 top
R9  89,63 270 top
R10  82,63 90 top
R11  78.5,63 270 top
R12  66,54.75 0 top
R13  40.25,34.5 180 top
R14  49,44.25 90 top
R15  45.25,44.25 270 top
R16  25.25,34.5 180 top
R17  96,56.75 270 top
R18  92.5,63 270 top
R19  99.5,56.75 270 top
R20  103,58.25 90 top
R21  106.5,58.25 90 top
R22  110,58.25 90 top
R23  117,58.25 90 top
R24  113.5,58.25 270 top
R25  87.5,34 270 top
R26  56,63 90 top
R27  52.5,63 270 top
R28  59.5,63 90 top
R29  5.5,48 90 top
R30  5.5,40.5 180 top
R31  10.5,65 90 bottom
R32  10,67.59 0 bottom
R33  19.25,39.25 180 bottom
R34  22.88,40.12 270 bottom
R35  14.75,42.16 180 bottom
R36  14.75,40.53 0 bottom
R37  41.75,45.75 270 bottom
R38  30.12,48.62 270 bottom
R39  41.75,49 270 bottom
R40  30.12,45.38 90 bottom
R41  73.12,64.88 0 bottom
R42  132.5,14 0 bottom
R43  132.5,12 180 bottom
R44  118,59.81 0 bottom
R45  102.62,59.12 180 bottom
R46  102.62,57.5 180 bottom
R47  127.78,68.5 270 bottom
R48  123,72.88 270 bottom
R49  118.62,69.75 270 bottom
R50  130.66,68.5 270 bottom
R51  125.25,72.88 270 bottom
R52  120.88,69.75 270 bottom
R53  90,59.5 180 bottom
R54  90,61.25 0 bottom
R55  121,57.62 0 bottom
R56  119.12,48.62 90 bottom
R57  121.88,55.12 270 bottom
R58  123.78,56.84 90 bottom
R59  118.25,46 0 bottom
R60  119.12,43.38 90 bottom
U1  110.88,59.12 180 bottom
U2  18.99,44.74 270 bottom
U3  35.15,43.96 0 bottom
U4  73.12,60.88 90 bottom
U5  90,64.5 180 bottom
U$2  67,43.25 0 top
X1  38,28 180 top
X2  128.5,16.5 90 top
ZX1  127,41.5 270 top

### Tracks (layer width: path | path; a pad name or v marks a point on that pad's centre or on a via)
+5V  (via drill 0.6, 0.8 pad 1.27)
  Top 0.406: v110.28,43.47 110.28,41.72 111.03,40.97 120.84,40.97 120.94,41.25 120.94,51.59 121.53,52.19 131.72,52.16 132.31,52.75 v132.31,58.5
  Top 0.813: U$2.1.1 59.62,43.09 50.66,43.06 49.72,43.59 v48.75,44.69
  Route15 0.406: v132.31,58.5 132.31,85.22 131.97,85.56 v128.69,85.56
  Route15 0.813: v48.75,44.69 48.75,48.25 47.97,48.81 28.22,48.81 27.78,49.09 v27.78,49.91
  Bottom 0.254: U3.12 30.94,43.71 R40.1
  Bottom 0.406: C29.1 110.28,45.38 v110.28,43.47
  Bottom 0.813: C29.1 CR2.2 108.41,45.29 108.41,43.84 108.31,43.75 101.34,43.75 100.12,44.97 98.66,44.97 98.25,45.38 75.38,45.38 73.03,47.78 63.31,47.78 62.3,46.77 U$2.1.1 | R40.1 C24.1 26.31,44.75 | 26.31,44.75 24,44.75 22.88,43.75 R34.1 | v27.78,49.91 26.31,49.16 26.31,44.75
+15V  (via drill 0.6, 0.8 pad 1.27)
  Top 0.5: v36.69,47.5 34.09,47.5 33.66,47.09 33.66,40.94 32.97,40.5 28.25,40.5 v27.97,40.78
  Top 1: v92.81,61.78 84.09,61.78 83.62,62.28 v83.62,64 83.62,63.97 | v78.28,64.09 65.16,64.09 64.84,63.78 64.84,62.31 v64.88,62.28
  Route2 1: U$2.3.1 70,45.64 70,47.06 68.22,48.8 68.22,52 67.77,52.47 67.66,52.59 67.53,52.72 67.53,55.58 67.11,56.27 67.07,56.32 66.22,57.71 65.36,57.71 64.84,58.62 64.84,62.31 v64.88,62.28 | v92.81,61.78 93.69,61.78 94.36,61.33 109.52,61.33 110.91,60.66 110.91,56.03 111.75,55.22 v116.66,55.22
  Route15 0.406: v128.69,79.75 128.69,73.62 128.06,73 125.62,73 125.14,72.5 LED.P2
  Route15 1: IC3.8 83.81,36.06 v80.62,38.97 | v116.66,55.22 123.25,55.19 124.31,56.34 124.31,61.59 125.16,62.01 125.16,63.26 LED.P2
  Bottom 0.254: C21.1 30.81,42.5 31.5,43.21 32.5,43.21 U3.11
  Bottom 0.305: 72.01,62.5 U4.5 | U3.13 33.82,44.21 33.94,44.12 33.94,43.3 33.82,43.22 33.62,43.21 U3.11 | U3.1 37.47,45.81 37.47,45.84
  Bottom 0.406: C28.1 70.25,63.5 71.25,62.5 72.01,62.5
  Bottom 0.5: 37.47,45.84 37.47,46.66 v36.69,47.5 | v27.97,40.78 27.97,42.16 27.62,42.5 | U5.8 92.2,62.39 v92.81,61.78
  Bottom 0.813: R35.1 14.03,44.4 14.06,44.44 | v64.88,62.28 69.22,62.28 69.38,62.53 69.38,63.38 C28.1
  Bottom 1: IC1.7 57.77,31.81 55.41,31.81 54.88,32.47 54.88,38.34 | 39.78,36.22 39.41,36.28 40.12,36.31 40.14,37.98 42.22,37.97 43.48,38.94 44.17,39.4 53.32,39.4 54.88,38.72 54.88,38.34 | 54.88,38.34 68.91,38.34 69.38,39.19 69.38,44 71.69,45.62 71.69,45.56 U$2.3.1 78.38,38.97 v80.62,38.97 | v83.62,64 78.38,64 v78.28,64.09
  Bottom 1.27: C19.+ 32.5,59.38 30.19,57.06 25.5,57.06 25,56.56 25,47.75 24.56,47.31 23.69,47.31 21.19,44.81 17.19,44.81 16.81,44.44 14.06,44.44 13.51,44.44 D3.C 12.44,41.69 11.06,40.06 11.06,37.94 12.38,36.22 24.81,36.22 | C21.1 27.62,42.5 26.06,42.5 24.88,41.31 24.88,37.06 24.81,36.22 | 39.78,36.22 24.81,36.22
-5V  (via drill 0.6, 0.8 pad 1.27)
  Top 0.406: v60.12,26.94 60.81,27.38 60.81,28.38 60.75,39.3 U$2.1.2
  Route15 0.406: v128.69,83.62 130.88,83.62 131.31,83.19 131.31,59.38 130.88,58.94 130.88,52.66 130.41,52.19 129.19,52.19 128.84,51.84 128.84,31.38 130,30.22 130,25.75 129.06,24.81 127.16,24.81 125.72,26.03 86.25,26.03 85.78,26.72 85.78,27.56 85.44,27.97 61.72,27.97 v60.12,26.94
  Bottom 0.305: U3.5 38.12,43.71 38.44,43.71 38.88,43.88 41.4,43.89 41.74,44.64 R37.2
  Bottom 0.813: R37.2 43.39,44.9 43.34,45 C23.1
  Bottom 1.27: C23.1 47.81,42.89 55.69,42.89 57.59,40.85 U$2.1.2
-15V  (via drill 0.6, 0.8 pad 1.27)
  Top 1: U$2.3.2 71.7,40.55 73.5,38.75 73.5,27.19 74,26.69 IC3.4
  Route2 0.406: v118.59,28.09 118.59,26.78 118.6,26.78 118,26.66 117.85,26.5 112.76,26.5 112.39,26.87 93.21,26.87 92.37,26.36 86.22,26.36 85.75,26.75 85.78,27.56 85.47,27.97 79.5,27.97 79.03,27.53 79.03,27.06 78.66,26.69 IC3.4
  Route15 0.406: v128.69,81.69 130,81.69 130.28,81.41 130.28,60.19 129.56,59.47 129.56,53.62 129.53,53.59 127.72,53.59 127.31,53.19 127.31,32.16 123.47,28.12 118.56,28.12 v118.59,28.09
  Route15 1: U$2.3.2 70.28,38.66 57.84,38.66 v55.84,40.56 55.84,28.31 53.44,26.69 IC1.4
  Bottom 0.305: U3.6 37.49,43.21 39.31,43.21 40,42.5 C20.1
  Bottom 1: 41.09,42.41 43.75,42.41 45.91,41.19 46.12,41.07 54.32,41.07 55.06,40.56 v55.84,40.56
  Bottom 1.27: C20.1 41.09,42.41
AGND  (via drill 0.5, 0.7 pad 1.27, 0.8 pad 1.27, 3.2 pad 6.45)
  other vias: 4.5,66.5 130.5,92.5 130.5,4.5 4.5,29.5 35.15,44 73.12,60.88 20.56,43.5 113.38,67.44 114.5,56.44 77.75,60.2 43.42,43.57 45.87,28.06 70.29,70.15 80.66,26.73
  pour Route2: 0,25 0,71 107.5,71 107.5,76 126,76 126,97 135,97 135,0 125,0 125,25
  pour Route15: 0,71 0,25 125,25 125,0 135,0 135,97 126,97 126,76 107.5,76 107.5,71
  pour Top: 0,71 107.5,71 107.5,76 126,76 126,97 135,97 135,0 125,0 125,25 0,25
  pour Bottom: 0,25 0,71 107.5,71 107.5,76 126,76 126,97 135,97 135,0 125,0 125,25
N$1  (via drill 0.6)
  Route2 0.406: v117.56,44.12 111.12,50.56 105.38,50.56 104.94,51 104.94,52.75 104.69,53 101.62,53 100.44,54.06 97.12,54.06 96.5,54.69 v96.5,58
  Route2 1: J2.1 11.52,32.83 13.38,34.69 13.38,54.06 13.88,54.56 18.19,54.56 18.56,54.94 18.56,67.98 J1.1
  Route15 0.406: v125.75,46.56 118.06,46.56 117.56,46.06 v117.56,44.12 | v96.5,58 95.12,59.44 94.62,59.44 94.12,60.06 87.88,60.06 86.94,61.25 81.5,61.25 79.88,63 79.88,64.69 79.12,65.06 67.25,65.06 66.81,65.5 66.81,69.44 66.12,70.12 61.25,70.12 60.06,68.19 44.38,68.19 43.88,70 18.81,70 18.56,69.75 18.56,68.02 J1.1
  Bottom 0.406: R57.2 122.71,53.44 125,53.44 125.75,52.69 v125.75,46.56
N$2
  Top 1: J1.3 13.46,64.75 | 13.46,64.75 13.46,31.66 14.06,30.88 14.06,28.07 J2.2 | J3.2 38,65.75 37.19,64.94 13.65,64.94 13.46,64.75
N$3
  Route2 1: X1.3 40,30.97 39.53,31.44 39.53,44.94 38.06,46.31 38.06,61.24 C1.1
  Bottom 0.813: J9.2 20.73,29.79 21.53,30.75 39.78,30.75 40,30.4 X1.3 | C1.1 38,64.1 CR1.2
N$4
  Top 1: R1.2 39.12,53.31 38.06,52.06 38.06,38.76 | 38.06,38.76 C1.2 | 38.06,38.76 38.06,35.94 39.25,34.75 41.25,34.75 43.12,33.06 44.69,33.06 46.88,31.41 46.88,29.88 47.69,29.25 50.17,29.25 IC1.3
N$5
  Top 1: C17.- 54.5,52.62 55.25,53.31 R1.1 59.65,51.45 R2.2
N$6
  Top 1: C3.1 109.65,39.2 C4.1 103.73,39.19 95.88,39.19 93.88,37.19 91.81,37.19 91,36.38 R5.2 | R14.1 49.04,37.94 53.56,37.94 54.75,37.12 54.75,32.88 53.77,31.77 IC1.2
  Route15 1: C3.1 109.61,28.46 C2.+
  Bottom 1: R5.2 91,35.94 90.53,36.41 61.84,36.41 61.06,35.94 61.06,29.88 60.44,29.28 57.86,29.28 IC1.6 52.81,29.23 52.74,29.31 IC1.2
N$7
  Top 1.27: D1.C R30.2
N$8
  Top 1: C17.+ 51.04,45.21 49,47.25 R14.2
N$9
  Bottom 0.305: U3.4 38.37,44.21 38.75,44.38 40.69,44.38 40.81,44.44 40.81,46.56 40.85,46.6 R37.1
  Bottom 0.813: R39.2 R37.1
N$10
  Top 1: C13.2 106.54,64.64 R21.2 | R21.2 R22.2 | R21.2 106.5,61.44 105.94,60.88 103.56,60.88 103,60.31 R20.1
  Route15 1: IC3.1 76.19,39.56 77.44,40.72 81.81,40.72 85.44,37.19 88.62,37.19 89.44,36.34 89.44,32 90.44,31.12 105.94,31.12 106.75,31.97 106.75,49.19 104.38,51.56 103.34,51.56 R20.1
N$11  (via drill 0.6)
  Top 0.813: P1.6 118.97,73 119.59,72.41 119.59,70.66 120.12,70.12 120.12,54.25 119.59,53.59 119.59,48.22 118.75,47.25 104,47.25 103.81,47.75
  Top 1: C4.2 103.81,49.27 103.81,47.75 103.81,44.12 102.77,43.08 C6.1 97.48,43.06 94.94,43.06 92.22,40.35 R5.1 | R8.2 85.72,56.65 87.22,55.16 87.22,43.06 v84.56,40.41
  Bottom 1: v84.56,40.41 84.56,39.03 84.97,38.5 90.62,38.5 91.06,39.06 91.06,40.29 R5.1
N$12  (via drill 0.6)
  Top 1: R3.2 R4.1
  Route15 0.813: 57.62,54.94 59.97,52.84
  Route15 1: R4.1 51.06,55.41 52.84,54.97 55.5,54.94 57.62,54.94 | 59.97,52.84 63.34,51.03 64.72,49.66 85.44,49.66 86.44,48.53 86.44,47.81 89.03,45.28 91.28,45.28 92.59,44.44 93.16,42.59 93.19,42.59 v93.16,38.81
  Bottom 1: C2.- 94.38,28.68 93.16,29.91 v93.16,38.81
N$13
  Top 1: R7.2 R6.2 75,66.77 75.75,65.93 79.5,65.93 80.33,65.09 80.31,55.62 82.05,53.58 C5.1
  Route2 1: C5.1 85,49.81 85.66,49.16 90.56,49.16 90.97,48.88 101.25,48.88 101.97,48.16 102.03,47.31 109.69,47.31 109.69,49.37 C3.2
N$14  (via drill 0.6)
  Top 1: R6.1 75,55.25 75.81,54.44 75.81,52.61 C5.2 82.74,41.16 75.28,41.16 73.22,43.22 v71.75,43.22
  Route2 1: IC2.3 63.17,29.23 62.88,28.94 61.78,28.94 61.09,30.06 61.09,38.81 59.34,39.88 59.34,42.69 59.78,43.22 v62.44,43.22
  Route15 1: v62.44,43.22 v71.75,43.22
  Bottom 1: J4.2 116.27,31.23 115.88,31.62 114.56,31.62 113.69,32.38 113.69,36.5 112.94,37.06 | 112.94,37.06 97.5,37.06 96.56,37.88 96.56,39.56 94.19,41.88 86.48,41.88 C5.2 | P1.5 114.75,69.31 114.12,68.69 112.41,68.69 111.59,68.03 111.59,63.41 110.91,62.09 110.91,56.78 111.84,55.34 111.84,48.72 113.12,47.41 113.66,47.41 114.41,46.59 114.41,44.53 112.94,42.5 112.94,37.06
N$15
  Top 1: R19.2 98.84,50.4 97.75,49.31 C16.+
  Bottom 1: R7.1 71.4,56.65 70,55.25 70,50.53 71.16,49.34 90.34,49.34 91.06,48.25 91.06,47.75 91.56,47.25 C16.+
N$16  (via drill 0.6)
  Top 1: R9.2 89,47.5 v89.06,47.44
  Route15 1: v89.06,47.44 91.06,47.44 93.78,45.59 94.66,44.16 94.97,42.62 94.97,33.78 95.84,33.06 97.42,33 C6.2
N$17  (via drill 0.6)
  Top 0.813: v94.25,67.69 94.25,69.34 94.94,70.03 108.5,70.03 109.03,70.59 109,72.69 109.31,73 P1.2
  Top 1: R8.1 R9.1
  Bottom 1: R9.1 89,67.69 v94.25,67.69
N$18  (via drill 0.6)
  Top 1: R22.1 R24.2 113.5,51.83 C14.1
  Route15 1: v111.84,34.53 111.84,48.56 112.5,49.22 115.89,49.22 C14.1
  Bottom 1: IC3.5 85.06,26.69 85.62,26.12 111.31,26.12 111.84,26.66 v111.84,34.53
N$19
  Top 1: U$2.2.1 68.29,45.65 69.44,44.5 69.44,39.25 68.94,38.12 68.94,32.12 69.38,31.75 70.79,31.75 IC2.7
N$20
  Top 1: IC2.4 65.25,26.69 67,28.44 U$2.2.2
N$21  (via drill 0.6)
  Top 1: R17.1 95.96,63.06 93.31,63.06 92.53,64.03 R18.1 92.5,69.41 91.22,67.91 91.12,67.81 90.46,66.96 90.31,66.81 81.58,66.81 80.59,67.66 77.95,67.66 v77.16,68.06 | v73.19,67.88 71.78,67.88 71.22,67.25 71.22,66.25 70.69,65.77 60.78,65.77 59.56,66.94 v59.56,67.19
  Route2 1: v104.59,63.22 101.5,63.22 101.5,63.94 100.84,64.44 96.56,64.44 96,64.03 R17.1 | R15.1 46.84,53.25 46.88,53.25 47.25,53.62 47.25,57.38 48.72,58.84 60.59,58.84 61.16,59.41 61.16,65.72 60.75,65.72 59.56,66.94 v59.56,67.19
  Bottom 1: P1.4 112.75,74.19 112.31,74.62 109.22,74.62 108.94,74.34 108.94,70.25 108.38,69.69 108.38,67.06 107.97,66.47 104.88,66.47 104.66,66.25 104.66,63.28 v104.59,63.22 | v77.16,68.06 76.25,67.88 v73.19,67.88
N$22
  Top 1: ZX1.4 ZX1.5
N$23
  Top 1: ZX1.13 ZX1.12
N$24  (via drill 0.6)
  Top 1: ZX1.16 ZX1.15 ZX1.14 127.12,45.31 125.91,44.09 125.91,30.97 124.72,29.78 120.53,29.78 120.53,29.81 118.94,31.41 107.81,31.41 106.69,32.53 106.69,35.88 105.5,37.06 99.84,37.06 99.25,36.47 v99.25,35.16 | v16.16,30.03 18.28,32.16 19.88,32.16 20.75,33.22 20.75,35.81 19.25,37.16 19.28,41.19 17.62,43.78 17.62,59.68 C10.1 16,63 16.25,63.25 v29.44,63.25
  Route15 1: v99.25,35.16 99.25,44.34 98.78,44.81 96.94,44.81 94.03,47.72 94.03,49 93.5,49.53 88.53,49.53 88.31,49.75 88.31,51.19 87.75,51.75 77.66,51.75 76.75,52.66 76.75,53.12 75.22,54.66 74.75,54.66 73.31,56.09 73.31,58.47 73.06,58.72 48.47,58.72 46.81,60.38 46.81,60.44 45.94,61.31 42.28,61.31 41.41,60.44 41.41,57.72 41.03,57.34 33.5,57.34 33.25,57.59 33.25,66.38 v32.41,67.22
  Bottom 0.61: 46.6,26.16 46.06,25.88 40.31,25.84 40,26.19 | 40,26.19 X1.4 | 40,26.19 39.78,25.84 16.91,25.84 16.16,26.34
  Bottom 0.813: R13.1 46.6,32.9 47.75,31.75 47.75,26.94 47.69,26.88 46.6,26.16 | 16.16,26.34 v16.16,30.03
  Bottom 1: v32.41,67.22 32.41,66.47 31.53,65.59 31.16,65.59 30.16,64.59 30.16,63.97 v29.44,63.25
N$25
  Route15 1: R21.1 106.5,53.62 105.94,54.19 95.38,54.19 94.62,55.12 77.38,55.12 76.62,55.69 76.62,62.56 75.69,63.88 63.94,63.94 62.94,65.34 62.94,67.98 J6.3
N$26
  Route2 1: J6.2 65.5,66.19 66.81,64.88 69.06,64.88 69.81,63.88 69.81,51 71.5,49.31 75.06,49.31 75.94,48.12 75.94,42.81 77.19,41.69 115.25,41.69 116,40.81 C14.2
N$27
  Top 1: ZX1.1 ZX1.2 ZX1.3
  Route15 1: ZX1.3 120.97,45.31 120.44,44.5 120.44,31.45 115.25,31.44 113.73,29.92 J4.1
N$28
  Top 1: R24.1 R23.2
  Route2 1: R23.2 116.94,64.54 116.94,62.19 117.56,61.56 119.12,61.56 119.69,61 119.69,36.62 117.81,34.75 C15.+ 117.62,31.5 117.31,31.19 87.75,31.19 87.19,31.75 83.83,31.75 IC3.7
N$29
  Route2 1: R10.1 82,64.88 83.12,65.78 100.25,65.78 100.84,66.44 107.41,66.44 108.25,67.28 108.25,68.47 110.69,69.94 110.69,70.94 P1.1
N$30
  Top 1: R11.1 R10.2
  Route2 1: C7.1 79,44.5 81,46.5 81,54.69 80.38,55.31 80.38,65.88 78.5,67.75 R11.1
N$31
  Top 1: R11.2 78.5,54.44 78.94,53.64 C7.2 | C8.2 67.79,56.27 69.12,54.94 | 69.12,54.94 69.31,54.75 R12.2 | IC2.2 64.71,31.77 65.31,32.38 65.31,38.38 64.75,39.06 64.75,50.44 69.12,54.94
  Route2 1: R12.2 77.56,54.75 78.5,55.25 R11.2
N$32  (via drill 0.6)
  Top 1: v110.19,66.19 111.75,65.19 111.75,63.5 110.94,62.06 110.94,56 112.19,55.06 112.19,53.88 114.46,53.88 R23.1
  Route15 1: J6.1 68.04,67.09 68.69,66.19 v110.19,66.19
N$33  (via drill 0.6)
  Top 1: C8.1 62.71,55.59 61.88,54.75 R12.1 58.56,54.94 54.19,54.94 52.94,54.44 48.38,54.44 47.06,55 27.5,55 26.94,55.94 26.94,61.24 C9.1 | ZX1.8 ZX1.7 ZX1.6 120.31,37.69 119.69,37.06 v116.25,37.06
  Route2 1: R12.1 64.06,54.75 64.72,54.12 64.72,38.19 65.06,37.84 65.91,37.84 67,36.56 67,30.75 68.71,29.23 IC2.6 71.79,29.23 73.19,30.62 73.19,35.5 74.06,36.38 95.56,36.38 96.31,37.12 116.19,37.12 v116.25,37.06
N$34  (via drill 0.5, 0.6)
  Top 1: R25.2 87.5,26.75 88.19,26.12 101.56,26.12 102.38,26.88 C15.-
  Route2 0.406: v87.31,57.44 87.31,52.34 87.91,51.44 88.75,51.41 88.97,51.09 91.25,51.09 91.78,50.56 93.84,50.56 94.25,51.06 94.25,52.38 95.06,52.75 100.19,52.75 v100.44,52.5
  Route15 0.406: v100.44,52.5 101.12,52.5 101.44,52.19 101.44,37.81 102.38,36.88 C15.-
  Bottom 0.406: U5.3 86.2,64.83 86,64.62 85.98,61.6 86.75,60.92 86.75,58 v87.31,57.44
N$35
  Route15 1: J7.3 24.46,65.85 25.25,65.06 30.31,65.06 31.31,64.06 31.31,56.19 32.38,54.88 47.5,54.94 48.44,53.44 54.62,53.44 56.56,51.31 58.69,49.44 60.5,47.75 83.75,47.75 84.72,45.91 85.53,45.91 85.5,45.88 87.5,43.53 R25.1
N$36
  Top 0.61: J9.1 18.19,26.43 18.78,25.84 41.72,25.84 42,26.06 X1.2
  Route2 0.813: J3.1 40.54,65.96 41.72,64.84 41.72,37.84 44.06,35.44 44.06,27 X1.2
N$37
  Top 1.27: C9.2 32.87,38.7 33.88,37.69 33.88,34.52 R13.2
N$38  (via drill 0.6)
  Top 1: R27.2 R26.1 R28.1 | J5.1 98.52,66.96 97.75,66.12 97.75,61.69 96.44,60.44 95.25,60.44 94.56,59.81 94.56,55 93.69,53.38 v92.81,51.69
  Route2 0.61: X1.8 36,26.31 36.16,25.84 47.42,25.84 48.19,26.38
  Route2 0.813: 48.19,26.38 48.19,36 47.47,36.81 47.5,51.41 48.16,52.16 51.69,52.16 52.5,53.03 R27.2
  Route15 1: v74.06,52.88 64.19,52.81 63.06,53.94 63.06,55.88 61.88,56.69 59.54,56.69 R28.1
  Bottom 1: v74.06,52.88 74.22,52.88 75.41,51.69 v92.81,51.69
N$39
  Top 1.27: C11.1 16.81,34.5 | 16.81,34.5 R16.2 | 16.81,34.5 16,35.31 C10.2
N$40
  Bottom 1: R15.2 44.95,37.41 43.89,36.6 43.34,36.33 41.82,34.76 41.81,33.72 41.08,32.66 39.47,32.65 39.34,32.65 20.3,32.69 19.24,32.25 9.44,32.25 8.94,32.81 C11.2
N$41  (via drill 0.6)
  Top 1: C13.1 101.5,66.44 101.94,65.88 R20.2 102.94,64.54 102.94,63.38 102.66,63.1 R19.1 99.5,55.94 98.69,54.75 96.88,54.75 96,53.75 R17.2 91,45.4 C12.1 89.28,41.61 89.28,37.56 88.62,37 80.34,37 79.84,36.5 79.84,30.59 78.48,29.23 IC3.3 | R16.1 31.81,34.5 31.81,32.94 32.62,32.12 41.44,32.12 42.56,31.25 43.91,31.25 v45.28,30.25
  Route2 1: v52.97,36.28 57.38,36.28 v58.69,36.75
  Route15 1: v58.69,36.75 73.09,36.75 73.53,36.31 73.53,29.75 74.09,29.19 76.15,29.19 IC3.3
  Bottom 1: v45.28,30.25 44.47,30.78 44.5,34.75 45.62,35.75 46.31,36.28 v52.97,36.28
N$42
  Top 1: R18.2 92.5,55.08 C12.2
N$43  (via drill 0.6)
  Top 0.813: J7.2 27,69.59 27.34,70.06 42.16,70.06 42.88,69.38 42.88,66.31 43.5,65.69 52.12,65.69 52.5,66.06 R27.1 | X1.9 30.12,29 28.69,30.44 28.69,32.94 28.06,33.56 25.56,33.56 24.62,34.5 v24.62,61.19
  Bottom 0.813: v24.62,61.19 24.62,63.88 25.31,64.56 26.81,64.56 27,64.75 J7.2 | CR3.2 31.35,28.16 32.19,29 X1.9
N$44  (via drill 0.6)
  Route2 0.813: v43.09,40.84 43.75,40.84 44.56,41.97 44.56,48.28 43.44,49.44 43.44,59.09 v44.06,59.62
  Route15 0.813: X1.1 42,29.59 43.06,30.66 43.06,40.81 v43.09,40.84
  Bottom 0.305: 47.24,59.61 K1.4
  Bottom 0.813: v44.06,59.62 47.24,59.61
N$45
  Bottom 0.5: K1.2 51.84,63.53 51.16,64.22 50.88,64.22 50.72,64.38 50.72,69.34 50.71,69.35 R4.2
N$46  (via drill 0.6)
  Top 1: R26.2 56.03,69.32 56.03,63.53 55,62.5 v49.66,62.5
  Route15 0.5: 48.25,26.5 48.25,26.44
  Route15 0.61: 48.25,26.44 47.38,25.84 32.97,25.84 32.5,26.31 32.5,30.44 32.69,30.62 35.75,30.62 36,30.38 X1.7
  Route15 0.813: v51.97,47.56 51.97,41.44 47.41,40.06 47.41,36.44 48.25,35.5 48.25,26.5
  Bottom 0.305: K1.3 49.67,59.6
  Bottom 0.5: v49.66,62.5 v49.65,62.5 K1.3
  Bottom 0.813: 49.67,59.6 50.75,58.34 50.75,53.75 52.38,52.69 52.38,47.72 v51.97,47.56
N$47
  Bottom 0.305: K1.1 55.2,59.58 55.28,59.39 | 71.9,59.32 72.13,59.31 U4.4
  Bottom 0.813: 55.28,59.39 70.66,59.38 71.08,59.32 71.9,59.32
N$48
  Bottom 0.305: U4.6 72.81,62.98 | K1.8 55.42,66.39 55.44,66.38
  Bottom 0.406: 72.81,62.98 72.81,63.12 72.8,63.33 72.25,63.88 72.25,64.85 R41.2
  Bottom 0.813: 55.44,66.38 57.5,66.38 58.79,65.13 70.79,65.13 71,64.88 R41.2
N$49
  Bottom 0.813: R52.2 Q3.E
N$50
  Bottom 0.813: R51.2 Q2.E
N$51  (via drill 0.6)
  Top 0.406: v81.88,43.69 81.62,43.69 75.5,49.81 67.25,49.81 66.94,50.19 v66.94,50.88
  Route2 0.406: v115.94,43.5 115.12,43.5 113.72,45.28 83.16,45.28 v81.88,43.69
  Route15 0.406: v58.62,46.88 56.69,46.88 55.81,47.75 54.12,47.75 51.44,50.44 51,50.44 50.62,50.81 50.62,51.75 50.25,52.12 22.19,52.12 21.69,51.62 21.69,37.25 22.44,36.5 22.44,35.56 23.25,34.75 23.25,28.02 J9.3
  Bottom 0.305: 114.62,59.12 U1.11
  Bottom 0.406: R44.2 116.28,59.34 115.41,59.12 114.62,59.12 | U1.11 112.81,59.12 112.38,58.69 112.38,56.81 112.81,56.38 112.81,56.31 115.25,53.88 115.25,51.25 113.81,49.81 113.81,49.38 115.94,47.25 v115.94,43.5 | v66.94,50.88 62.12,50.88 v58.62,46.88
N$52  (via drill 0.6)
  Route15 0.5: v17.28,39.94 16.62,40.59 11.84,40.59 10.78,41.66 10.78,55.97 12.03,57.22 v12.03,65.06
  Bottom 0.5: R33.1 18.36,39.3 U2.7 18.34,39.31 17.72,39.94 v17.28,39.94 | v12.03,65.06 12,65.09 12,66.19 11.98,66.26 10.85,66.26
  Bottom 0.813: R32.1 10.85,66.26 R31.2
N$53
  Bottom 0.813: R50.2 Q1.E
N$54
  Top 1.27: R30.1 D2.C
  Bottom 0.406: U2.1 U2.2 17.77,48.15 17.69,48.23 17.69,48.25
  Bottom 0.813: L1.4 9.25,62.9 R31.1
  Bottom 1.27: L1.4 L1.1 17.75,56.75 | 17.75,56.75 C18.+ | 17.75,56.75 17.75,48.31 17.69,48.25 | R30.1 8.19,40.5 11.06,43.25 11.06,46 11.62,46.62 16.19,46.62 17.77,48.15
N$55
  Bottom 0.254: U3.8 U3.7
  Bottom 0.406: 37.47,40.94 37.47,40.91
  Bottom 0.813: C22.1 36.88,40.38 37.47,40.94 | 37.47,40.91 37.47,42.44 U3.8
N$56  (via drill 0.6)
  Route2 0.5: v19.56,50.38 19.44,50.5 v15.44,50.5
  Bottom 0.5: U2.3 19.62,50.31 v19.56,50.38 | 13.56,50.44 14.12,50.5 v15.44,50.5
  Bottom 1.27: L1.3 L1.2 13.56,51.36 13.56,50.44 D3.A
N$57
  Bottom 0.406: 16.94,41.75 U2.8
  Bottom 0.813: R36.1 R35.2 16.94,41.75
N$59
  Bottom 0.254: R40.2 30.34,46.23 31.31,45.22 32.79,45.22 U3.15
  Bottom 0.813: R38.2 R40.2
N$60
  Bottom 0.305: U4.7 73.44,63.05
  Bottom 0.406: 73.44,63.05 73.44,63.31 73.88,63.75 73.88,64.78 R41.1 76.16,64.88 76.62,64.53 C27.1
N$61
  Bottom 0.406: U5.2 87.75,64.12 87.75,63.58 U5.1 87.8,61.45 88,61.25 R54.2
N$62
  Bottom 0.305: 114.7,57.81 U1.13
  Bottom 0.406: R56.2 119.12,56.59 118.84,56.88 116.88,56.88 116.34,57.41 115.62,57.41 115.22,57.81 114.7,57.81
  Bottom 0.5: R56.2 120.59,49.48 121,49.06 121,26.94 121.66,26.28 125.78,26.28 126.47,25.59 126.47,19.38 126.78,19.06 128.48,19.06 X2.4
N$63
  Bottom 0.254: U3.16 32.83,45.79 32.88,45.98
  Bottom 0.305: 32.83,47.46 C26.1
  Bottom 0.813: 32.88,45.98 32.88,47.44 C26.1
N$64
  Bottom 0.305: U1.12 113.94,58.5 114.69,58.48
  Bottom 0.406: 114.69,58.48 115.4,58.48 115.88,58 116.75,58 117.12,57.62 R55.2
  Bottom 0.5: R55.2 120.15,58.49 120.93,59.06 125.07,59.07 125.25,58.48 125.68,56.91 125.81,56.25 133,56.25 133.47,55.66 133.5,22.22 133.12,21.59 128.51,21.59 X2.5
N$65
  Bottom 0.305: U3.3 38.06,44.72 38.38,44.72 38.72,44.84 39.75,44.84 C25.1
N$66  (via drill 0.6)
  Route2 0.406: v109.66,63 111.41,63 112.03,63.62 112.03,65.44 113.09,66.5 128.03,66.5 128.88,65.72 128.81,31.5 126.03,31.5 125.19,30.66 125.19,26.66 126.34,25.56 126.34,11.81 126.97,11.34 128.42,11.34 X2.1
  Bottom 0.406: U1.4 109.5,59.12 109.84,59.44 109.84,62.66 v109.66,63
  Bottom 0.813: X2.1 130.04,11.42 130.62,12 R43.1
N$67
  Bottom 0.305: 107.01,57.81 U1.2
  Bottom 0.406: 107.01,57.81 104.5,57.81 104.12,57.5 R46.2 103.47,55.47 103.15,55.12 103.08,55.07 102.42,54.4 96.88,54.4 96.13,55.15 74.19,55.12 73.38,55.94 73.38,57.22 72.78,57.81 53.91,57.81 53.47,58.25 53.47,66.16 53.23,66.39 K1.7
N$69  (via drill 0.6)
  Top 0.406: v35.44,62.59 46.31,62.59 47.78,61.12 56.5,61.12 57.47,62.34 57.47,63.38 58.19,64.09 63,64.06 63.5,63.59 63.53,62.31 64.53,61 66.12,61 66.51,61.53 66.51,62.36 66.73,62.58 78.22,62.58 78.56,62.27 v78.56,61.75
  Route2 0.406: X1.6 38,27.03 37,28.06 37,32.84 36.22,33.59 36.22,45.81 35.41,46.62 35.41,62.56 v35.44,62.59
  Route15 0.406: v78.56,61.75 78.56,58.88 79,58.44 92.59,58.44 v92.62,58.47
  Bottom 0.305: 107,58.47 U1.3
  Bottom 0.406: 107,58.47 104.88,58.47 104.25,59.12 R45.2 103.47,60.06 103.31,60.25 93,60.25 92.62,59.88 v92.62,58.47
N$70
  Bottom 0.813: R42.1 R43.2 133.35,9.68 C30.1
N$71
  Bottom 0.813: LED.P1 127.34,63.77 Q1.C
N$72  (via drill 0.6)
  Route2 0.5: v106.03,59.56 85.62,59.56 v85.59,59.53
  Bottom 0.305: U1.5 106.24,59.77 v106.03,59.56 | 74.22,62.41 74.11,62.41 U4.8
  Bottom 0.5: v85.59,59.53 78.53,59.53 78.06,59.06 78.06,58.34 77.81,58.09 75.62,58.09 75.16,58.56 75.16,62.12 75.12,62.16 75.12,62.22 74.94,62.41 74.22,62.41
N$73
  Bottom 0.305: 114.72,59.77 U1.10
  Bottom 0.406: Q1.B 129.02,66.96 129.16,67.62 129.16,70.34 129.62,70.84 131.94,70.84 132.44,70.47 132.44,62.08 132.42,62.07 132.11,61.76 131.59,61.23 123.93,61.24 123.45,61.71 122.47,61.71 122.07,62.02 117.04,62.02 116.06,61.09 115.72,60.56 115.4,59.96 115.34,59.91 114.72,59.77
  Bottom 0.813: R47.2 Q1.B
N$74
  Bottom 0.305: U1.9 113.42,60.42 113.03,60.44
  Bottom 0.406: 113.03,60.44 112.44,60.44 112.31,60.56 112.31,61.75 113.16,62.59 113.25,62.59 114.62,63.97 114.62,67.22 115.78,68.38 116.56,68.38 116.97,68.78 116.97,71.69 117.28,72 122.97,72 R48.2
  Bottom 0.813: R48.2 Q2.B
N$75
  Bottom 0.305: 113.97,61.27 U1.8
  Bottom 0.406: Q3.B 116.22,67.22 115.69,66.69 115.69,63.19 113.97,61.81 113.97,61.27
  Bottom 0.813: R49.2 Q3.B
N$76  (via drill 0.6)
  Top 0.406: v29.72,59.19 39.22,59.19 40.09,58.31 58.28,58.31 58.78,58.81 v58.78,61.25
  Route2 0.406: v23.12,37.69 24.22,37.69 24.94,38.41 24.94,58.53 25.62,59.22 29.69,59.22 v29.72,59.19
  Route15 0.406: v107.94,63.12 106.38,63.12 105.88,62.62 105.88,61.59 105.44,61.28 95.06,61.28 93.91,63.38 91.38,63.38 91.06,62.69 85.56,62.69 v85.09,63.16 | v61.19,68.25 61.19,62.16 60.94,61.91 59.38,61.91 58.78,61.31 v58.78,61.25
  Bottom 0.406: U1.6 108.92,60.42 109.12,60.62 109.12,61.94 v107.94,63.12 | R34.2 22.88,37.94 v23.12,37.69 | v85.09,63.16 85.09,65.53 84.34,66.41 70.22,66.41 69.62,66.88 69.62,69.5 68.94,70.19 62,70.19 61.22,69.41 61.22,68.28 v61.19,68.25
  Bottom 0.5: U2.6 19.62,40.62 20.06,40.19 20.06,39.29 R33.2
  Bottom 0.813: R33.2 22.85,39.25 R34.2
N$77
  Bottom 0.813: Q2.C 124.12,64.97 LED.P3
N$78
  Bottom 0.813: Q3.C 119.75,64.88 121.25,63.38 122.51,63.38 LED.P4
N$79
  Bottom 0.305: 107.84,61.12 107.86,61.06 U1.7
  Bottom 0.406: U5.6 U5.7 101.23,64.17 101.5,63.91 101.5,62.38 101.88,62 107.84,62 107.84,61.12
N$80
  Bottom 0.813: R56.1 119.12,46.02 R59.1 119.1,44.25 R60.2
N$81
  Bottom 0.406: R54.1 90.85,62.02 89.88,63 89.88,65 90.38,65.5 92.17,65.5 U5.5
  Bottom 0.813: R54.1 R53.2
N$82
  Bottom 0.813: R57.1 121.88,57.6 R55.1 122.41,57.65 R58.2
N$83
  Bottom 0.254: U3.10 U3.9 32.83,42.41
  Bottom 0.813: C22.2 32.83,40.38 32.83,41.81 32.83,42.44 32.83,42.41
V+  (via drill 0.5, 0.6)
  Top 0.406: v104.44,68.5 105,68.81 105.38,69.25 107.69,69.25 108.06,68.81 118,68.81 118.31,68.44 118.31,63.56 117.06,62.12 117.06,57.44 118.38,56.12 118.38,51.19 v117.62,50.44
  Top 1.27: R29.1 D1.A
  Route2 0.406: v76.81,69.44 76.06,68.94 76.06,66.56 75.62,66.19 70.44,66.19 69.62,66.81 69.62,69.5 68.94,70.19 61.25,70.19 60.06,68.19 58.2,68.19 57.53,67.52 45.05,67.52 44.35,68.22 44.38,68.19 43.88,69.63 16.56,69.63 16,69.29 J1.2
  Route2 1: R29.1 8.04,57.6 15,64.56 15.75,64.56 16,65.06 J1.2
  Route15 0.406: v104.44,68.5 104.44,69.88 104,70.06 94.62,70.06 92.88,68.06 92.75,67.69 78.5,67.69 78.06,67.12 76.44,67.12 76.06,67.25 76.06,68.94 v76.81,69.44
  Bottom 0.406: v117.62,50.44 117.38,49.94 117.38,46.02 R59.2
VDD  (via drill 0.6, 0.8 pad 1.27)
  Top 0.5: v121.81,60.44 132.5,60.44 132.5,60.41 | 132.5,60.41 133.62,61.66 133.62,86.75 133.06,87.5 v128.69,87.5 | X2.2 132.96,14.02 133.56,14.97 133.56,59.12 132.5,60.41
  Route2 0.5: v101.28,56.16 104.39,56.15 105.61,53.97 110.03,53.97 v110.09,53.91 117.53,53.91 118,54.38 v118,58.56
  Bottom 0.305: 107.88,56.92 U1.1
  Bottom 0.406: C31.1 107.88,56.92
  Bottom 0.5: R46.1 101.78,56.23 v101.28,56.16 | v110.09,53.91 110.09,55 109.69,55.41 107.89,55.41 C31.1 | v121.81,60.44 120.41,60.44 119.81,59.81 R44.1 118.76,58.88 v118,58.56
  Bottom 0.813: X2.2 131.61,13.96 R42.2 | C31.1 107.88,53.12 108.25,52.59 108.25,51.22 107.44,50.19 106.41,50.19 105.94,49.72 105.94,45.39 CR2.1 | R45.1 R46.1

### Text on the board
tPlace: ICSPCLK | ICSPDAT | VSS | VDD | !MCLR!
tDocu: VDD | +5V | -5V | -15V | +15V | Abu Tarek Akram Sadek | SIRIUS K | Transparent / Overdrive | 2021 | Soft | Hard | CLIPPING DIODES | ±15V [30V] | ±5V [10V] | GAIN HEADROOM